# EAGLE schematic 26-de-8x (EAGLE 6.6.0)

## Sheet 1 of 4
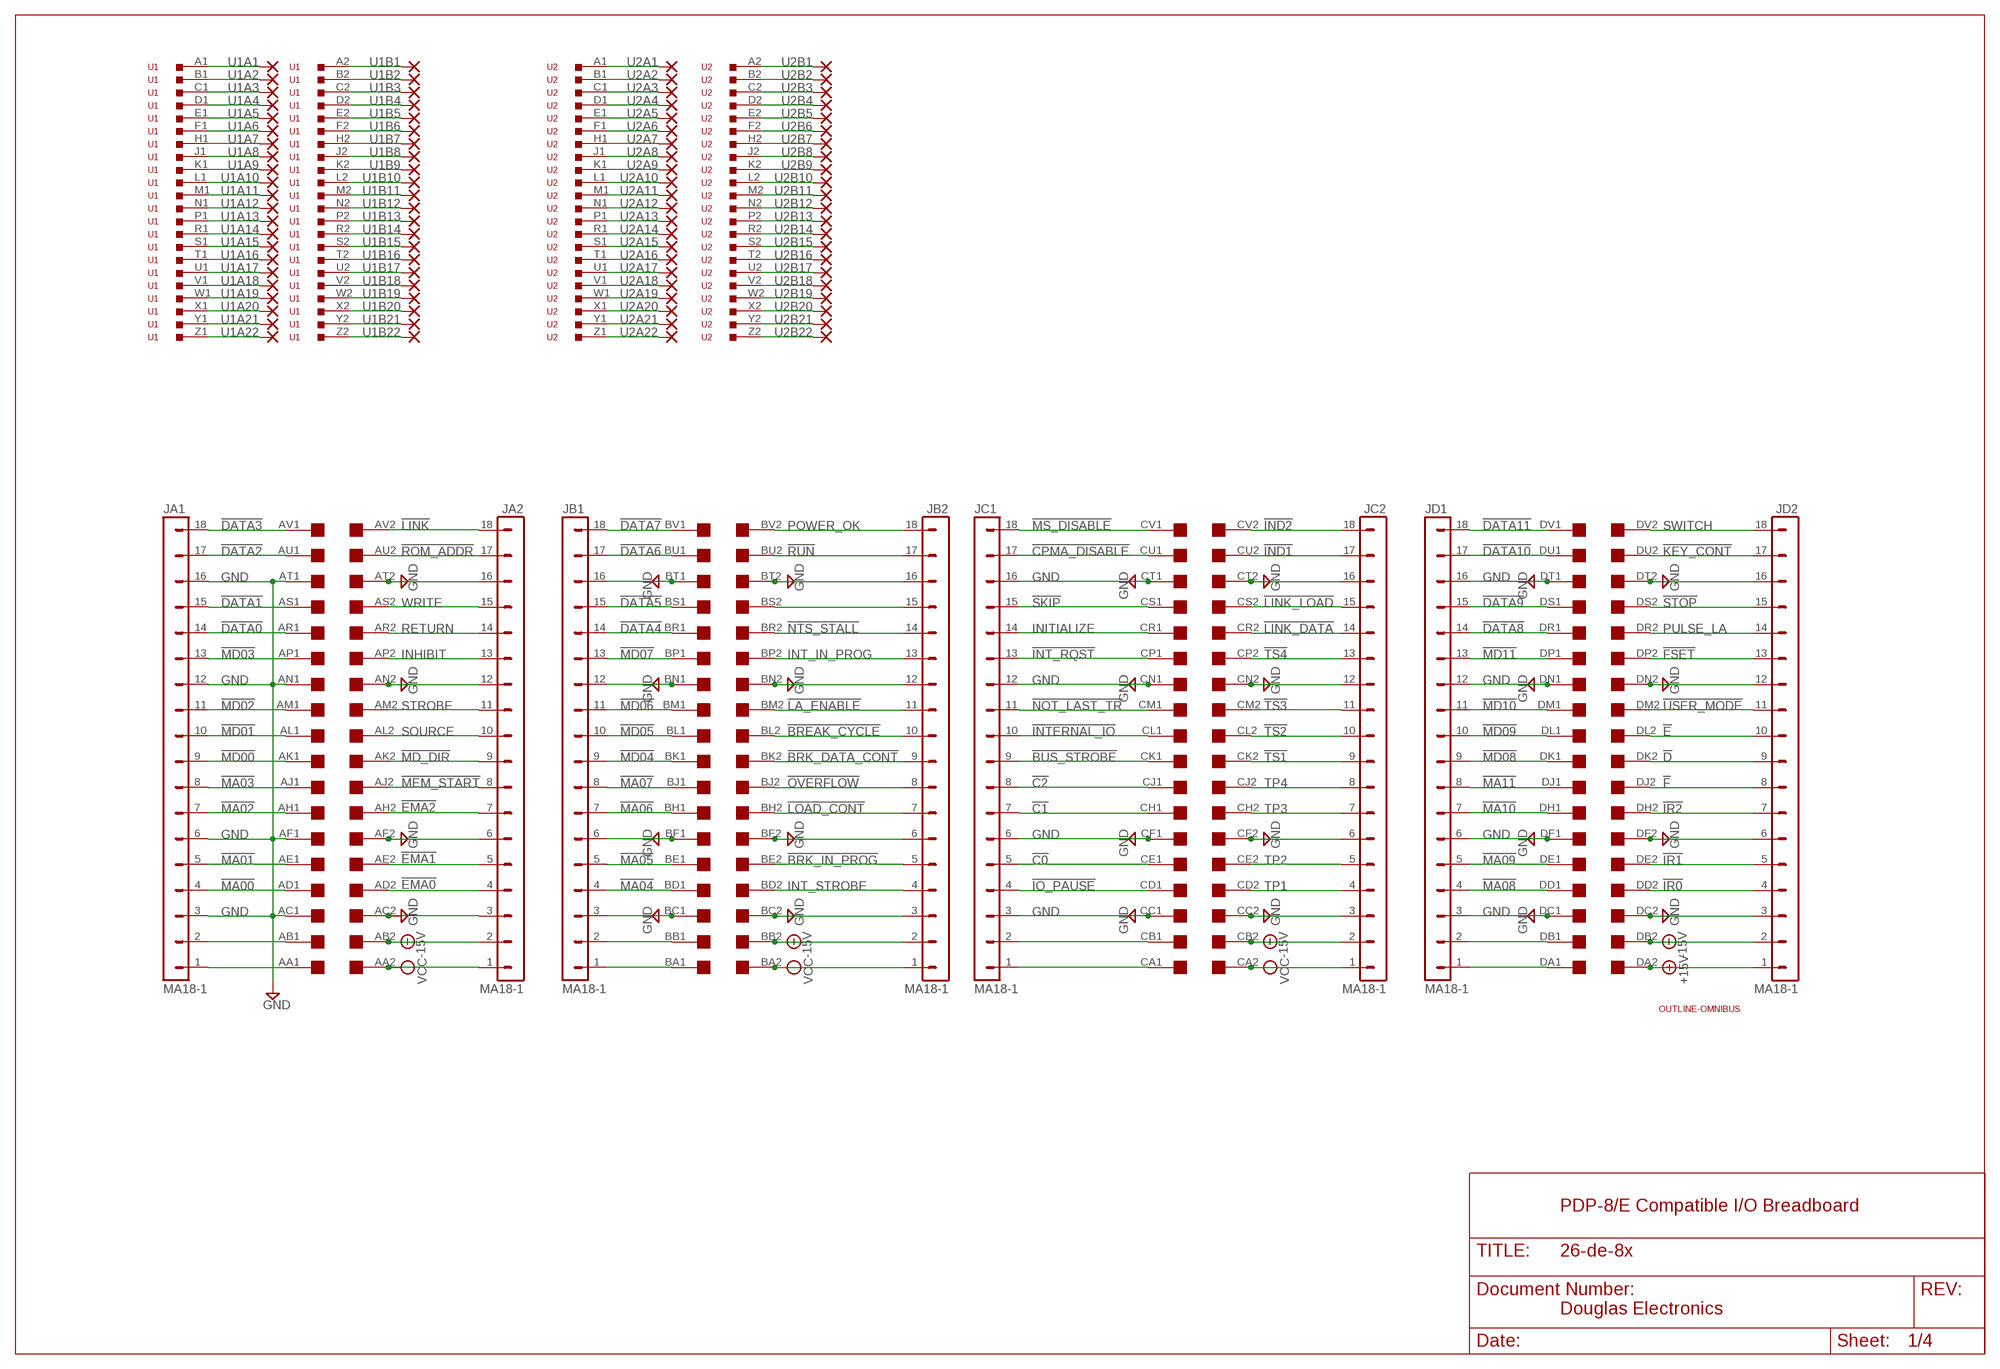
[diagram p0: schematic, sheet 1]

### Parts
JA1  MA18-1  [MA18-1]
JA2  MA18-1  [MA18-1]
JB1  MA18-1  [MA18-1]
JB2  MA18-1  [MA18-1]
JC1  MA18-1  [MA18-1]
JC2  MA18-1  [MA18-1]
JD1  MA18-1  [MA18-1]
JD2  MA18-1  [MA18-1]
U1  133-022-03  [133-022-03]
U1A1  1,6/0,8  [1,6/0,8]
U1A2  1,6/0,8  [1,6/0,8]
U1A3  1,6/0,8  [1,6/0,8]
U1A4  1,6/0,8  [1,6/0,8]
U1A5  1,6/0,8  [1,6/0,8]
U1A6  1,6/0,8  [1,6/0,8]
U1A7  1,6/0,8  [1,6/0,8]
U1A8  1,6/0,8  [1,6/0,8]
U1A9  1,6/0,8  [1,6/0,8]
U1A10  1,6/0,8  [1,6/0,8]
U1A11  1,6/0,8  [1,6/0,8]
U1A12  1,6/0,8  [1,6/0,8]
U1A13  1,6/0,8  [1,6/0,8]
U1A14  1,6/0,8  [1,6/0,8]
U1A15  1,6/0,8  [1,6/0,8]
U1A16  1,6/0,8  [1,6/0,8]
U1A17  1,6/0,8  [1,6/0,8]
U1A18  1,6/0,8  [1,6/0,8]
U1A19  1,6/0,8  [1,6/0,8]
U1A20  1,6/0,8  [1,6/0,8]
U1A21  1,6/0,8  [1,6/0,8]
U1A22  1,6/0,8  [1,6/0,8]
U1B1  1,6/0,8  [1,6/0,8]
U1B2  1,6/0,8  [1,6/0,8]
U1B3  1,6/0,8  [1,6/0,8]
U1B4  1,6/0,8  [1,6/0,8]
U1B5  1,6/0,8  [1,6/0,8]
U1B6  1,6/0,8  [1,6/0,8]
U1B7  1,6/0,8  [1,6/0,8]
U1B8  1,6/0,8  [1,6/0,8]
U1B9  1,6/0,8  [1,6/0,8]
U1B10  1,6/0,8  [1,6/0,8]
U1B11  1,6/0,8  [1,6/0,8]
U1B12  1,6/0,8  [1,6/0,8]
U1B13  1,6/0,8  [1,6/0,8]
U1B14  1,6/0,8  [1,6/0,8]
U1B15  1,6/0,8  [1,6/0,8]
U1B16  1,6/0,8  [1,6/0,8]
U1B17  1,6/0,8  [1,6/0,8]
U1B18  1,6/0,8  [1,6/0,8]
U1B19  1,6/0,8  [1,6/0,8]
U1B20  1,6/0,8  [1,6/0,8]
U1B21  1,6/0,8  [1,6/0,8]
U1B22  1,6/0,8  [1,6/0,8]
U2  133-022-03  [133-022-03]
U2A1  1,6/0,8  [1,6/0,8]
U2A2  1,6/0,8  [1,6/0,8]
U2A3  1,6/0,8  [1,6/0,8]
U2A4  1,6/0,8  [1,6/0,8]
U2A5  1,6/0,8  [1,6/0,8]
U2A6  1,6/0,8  [1,6/0,8]
U2A7  1,6/0,8  [1,6/0,8]
U2A8  1,6/0,8  [1,6/0,8]
U2A9  1,6/0,8  [1,6/0,8]
U2A10  1,6/0,8  [1,6/0,8]
U2A11  1,6/0,8  [1,6/0,8]
U2A12  1,6/0,8  [1,6/0,8]
U2A13  1,6/0,8  [1,6/0,8]
U2A14  1,6/0,8  [1,6/0,8]
U2A15  1,6/0,8  [1,6/0,8]
U2A16  1,6/0,8  [1,6/0,8]
U2A17  1,6/0,8  [1,6/0,8]
U2A18  1,6/0,8  [1,6/0,8]
U2A19  1,6/0,8  [1,6/0,8]
U2A20  1,6/0,8  [1,6/0,8]
U2A21  1,6/0,8  [1,6/0,8]
U2A22  1,6/0,8  [1,6/0,8]
U2B1  1,6/0,8  [1,6/0,8]
U2B2  1,6/0,8  [1,6/0,8]
U2B3  1,6/0,8  [1,6/0,8]
U2B4  1,6/0,8  [1,6/0,8]
U2B5  1,6/0,8  [1,6/0,8]
U2B6  1,6/0,8  [1,6/0,8]
U2B7  1,6/0,8  [1,6/0,8]
U2B8  1,6/0,8  [1,6/0,8]
U2B9  1,6/0,8  [1,6/0,8]
U2B10  1,6/0,8  [1,6/0,8]
U2B11  1,6/0,8  [1,6/0,8]
U2B12  1,6/0,8  [1,6/0,8]
U2B13  1,6/0,8  [1,6/0,8]
U2B14  1,6/0,8  [1,6/0,8]
U2B15  1,6/0,8  [1,6/0,8]
U2B16  1,6/0,8  [1,6/0,8]
U2B17  1,6/0,8  [1,6/0,8]
U2B18  1,6/0,8  [1,6/0,8]
U2B19  1,6/0,8  [1,6/0,8]
U2B20  1,6/0,8  [1,6/0,8]
U2B21  1,6/0,8  [1,6/0,8]
U2B22  1,6/0,8  [1,6/0,8]
U$1  OUTLINE-OMNIBUS  [OMNIBUS]
U$2  QUAD  [EDGE-CON8]

### Nets
!BREAK_CYCLE: JB2.10 U$2.BL2
!BRK_DATA_CONT: JB2.9 U$2.BK2
!BRK_IN_PROG: JB2.5 U$2.BE2
!BUS_STROBE: JC1.9 U$2.CK1
!C0: JC1.5 U$2.CE1 ; also sheet 2
!C1: JC1.7 U$2.CH1 ; also sheet 2
!C2: JC1.8 U$2.CJ1
!CPMA_DISABLE: JC1.17 U$2.CU1
!D: JD2.9 U$2.DK2
!DATA0: JA1.14 U$2.AR1 ; also sheet 2
!DATA1: JA1.15 U$2.AS1 ; also sheet 2
!DATA2: JA1.17 U$2.AU1 ; also sheet 2
!DATA3: JA1.18 U$2.AV1 ; also sheet 2
!DATA4: JB1.14 U$2.BR1 ; also sheet 2
!DATA5: JB1.15 U$2.BS1 ; also sheet 2
!DATA6: JB1.17 U$2.BU1 ; also sheet 2
!DATA7: JB1.18 U$2.BV1 ; also sheet 2
!DATA8: JD1.14 U$2.DR1 ; also sheet 2
!DATA9: JD1.15 U$2.DS1 ; also sheet 2
!DATA10: JD1.17 U$2.DU1 ; also sheet 2
!DATA11: JD1.18 U$2.DV1 ; also sheet 2
!E: JD2.10 U$2.DL2
!EMA0: JA2.4 U$2.AD2
!EMA1: JA2.5 U$2.AE2
!EMA2: JA2.7 U$2.AH2
!F: JD2.8 U$2.DJ2
!FSET: JD2.13 U$2.DP2
!IND1: JC2.17 U$2.CU2
!IND2: JC2.18 U$2.CV2
!INT_RQST: JC1.13 U$2.CP1 ; also sheet 2
!INTERNAL_IO: JC1.10 U$2.CL1 ; also sheet 2
!IO_PAUSE: JC1.4 U$2.CD1 ; also sheet 2
!IR0: JD2.4 U$2.DD2
!IR1: JD2.5 U$2.DE2
!IR2: JD2.7 U$2.DH2
!KEY_CONT: JD2.17 U$2.DU2
!LA_ENABLE: JB2.11 U$2.BM2
!LINK: JA2.18 U$2.AV2
!LINK_DATA: JC2.14 U$2.CR2
!LINK_LOAD: JC2.15 U$2.CS2
!LOAD_CONT: JB2.7 U$2.BH2
!MA00: JA1.4 U$2.AD1
!MA01: JA1.5 U$2.AE1
!MA02: JA1.7 U$2.AH1
!MA03: JA1.8 U$2.AJ1
!MA04: JB1.4 U$2.BD1
!MA05: JB1.5 U$2.BE1
!MA06: JB1.7 U$2.BH1
!MA07: JB1.8 U$2.BJ1
!MA08: JD1.4 U$2.DD1
!MA09: JD1.5 U$2.DE1
!MA10: JD1.7 U$2.DH1
!MA11: JD1.8 U$2.DJ1
!MD00: JA1.9 U$2.AK1
!MD01: JA1.10 U$2.AL1
!MD02: JA1.11 U$2.AM1
!MD03: JA1.13 U$2.AP1 ; also sheet 2
!MD04: JB1.9 U$2.BK1 ; also sheet 2
!MD05: JB1.10 U$2.BL1 ; also sheet 2
!MD06: JB1.11 U$2.BM1 ; also sheet 2
!MD07: JB1.13 U$2.BP1 ; also sheet 2
!MD08: JD1.9 U$2.DK1 ; also sheet 2
!MD09: JD1.10 U$2.DL1 ; also sheet 2
!MD10: JD1.11 U$2.DM1 ; also sheet 2
!MD11: JD1.13 U$2.DP1 ; also sheet 2
!MD_DIR: JA2.9 U$2.AK2
!MEM_START: JA2.8 U$2.AJ2
!MS_DISABLE: JC1.18 U$2.CV1
!NOT_LAST_TR: JC1.11 U$2.CM1
!NTS_STALL: JB2.14 U$2.BR2
!OVERFLOW: JB2.8 U$2.BJ2
!ROM_ADDR: JA2.17 U$2.AU2
!RUN: JB2.17 U$2.BU2
!SKIP: JC1.15 U$2.CS1 ; also sheet 2
!STOP: JD2.15 U$2.DS2
!TS1: JC2.9 U$2.CK2
!TS2: JC2.10 U$2.CL2
!TS3: JC2.11 U$2.CM2
!TS4: JC2.13 U$2.CP2
!USER_MODE: JD2.11 U$2.DM2
+15V: JD2.1 U$2.DA2
-15V [supply]: JA2.2 JB2.2 JC2.2 JD2.2 U$2.AB2 U$2.BB2 U$2.CB2 U$2.DB2
GND [supply]: JA1.3 JA1.6 JA1.12 JA1.16 JA2.3 JA2.6 JA2.12 JA2.16 JB1.3 JB1.6 JB1.12 JB1.16 JB2.3 JB2.6 JB2.12 JB2.16 JC1.3 JC1.6 JC1.12 JC1.16 JC2.3 JC2.6 JC2.12 JC2.16 JD1.3 JD1.6 JD1.12 JD1.16 JD2.3 JD2.6 JD2.12 JD2.16 U$2.AC1 U$2.AC2 U$2.AF1 U$2.AF2 U$2.AN1 U$2.AN2 U$2.AT1 U$2.AT2 U$2.BC1 U$2.BC2 U$2.BF1 U$2.BF2 U$2.BN1 U$2.BN2 U$2.BT1 U$2.BT2 U$2.CC1 U$2.CC2 U$2.CF1 U$2.CF2 U$2.CN1 U$2.CN2 U$2.CT1 U$2.CT2 U$2.DC1 U$2.DC2 U$2.DF1 U$2.DF2 U$2.DN1 U$2.DN2 U$2.DT1 U$2.DT2 ; also sheet 2,3,4
INHIBIT: JA2.13 U$2.AP2
INITIALIZE: JC1.14 U$2.CR1
INT_IN_PROG: JB2.13 U$2.BP2
INT_STROBE: JB2.4 U$2.BD2
N$46: JA1.2 U$2.AB1
N$47: JA1.1 U$2.AA1
N$48: JB1.2 U$2.BB1
N$49: JB1.1 U$2.BA1
N$50: JC1.1 U$2.CA1
N$51: JB2.15 U$2.BS2
N$52: JC1.2 U$2.CB1
N$53: JD1.1 U$2.DA1
N$54: JD1.2 U$2.DB1
N$243: U1.A2 U1B1.1(P)
N$244: U1.B1 U1A2.1(P)
N$245: U1.C1 U1A3.1(P)
N$246: U1.D1 U1A4.1(P)
N$479: U1.E1 U1A5.1(P)
N$480: U1.F1 U1A6.1(P)
N$481: U1.H1 U1A7.1(P)
N$482: U1.J1 U1A8.1(P)
N$483: U1.K1 U1A9.1(P)
N$484: U1.L1 U1A10.1(P)
N$485: U1.M1 U1A11.1(P)
N$486: U1.N1 U1A12.1(P)
N$487: U1.P1 U1A13.1(P)
N$488: U1.R1 U1A14.1(P)
N$489: U1.S1 U1A15.1(P)
N$490: U1.T1 U1A16.1(P)
N$491: U1.U1 U1A17.1(P)
N$492: U1.V1 U1A18.1(P)
N$493: U1.W1 U1A19.1(P)
N$494: U1.X1 U1A20.1(P)
N$495: U1.Y1 U1A21.1(P)
N$496: U1.Z1 U1A22.1(P)
N$497: U1.A1 U1A1.1(P)
N$498: U1.B2 U1B2.1(P)
N$499: U1.C2 U1B3.1(P)
N$500: U1.D2 U1B4.1(P)
N$501: U1.E2 U1B5.1(P)
N$502: U1.F2 U1B6.1(P)
N$503: U1.H2 U1B7.1(P)
N$504: U1.J2 U1B8.1(P)
N$505: U1.K2 U1B9.1(P)
N$506: U1.L2 U1B10.1(P)
N$507: U1.M2 U1B11.1(P)
N$508: U1.N2 U1B12.1(P)
N$509: U1.P2 U1B13.1(P)
N$510: U1.R2 U1B14.1(P)
N$511: U1.S2 U1B15.1(P)
N$512: U1.T2 U1B16.1(P)
N$513: U1.U2 U1B17.1(P)
N$514: U1.V2 U1B18.1(P)
N$515: U1.W2 U1B19.1(P)
N$516: U1.X2 U1B20.1(P)
N$517: U1.Y2 U1B21.1(P)
N$518: U1.Z2 U1B22.1(P)
N$519: U2.A1 U2A1.1(P)
N$520: U2.A2 U2B1.1(P)
N$521: U2.B1 U2A2.1(P)
N$522: U2.C1 U2A3.1(P)
N$523: U2.D1 U2A4.1(P)
N$524: U2.E1 U2A5.1(P)
N$525: U2.F1 U2A6.1(P)
N$526: U2.H1 U2A7.1(P)
N$527: U2.J1 U2A8.1(P)
N$528: U2.K1 U2A9.1(P)
N$529: U2.L1 U2A10.1(P)
N$530: U2.M1 U2A11.1(P)
N$531: U2.N1 U2A12.1(P)
N$532: U2.P1 U2A13.1(P)
N$533: U2.R1 U2A14.1(P)
N$534: U2.S1 U2A15.1(P)
N$535: U2.T1 U2A16.1(P)
N$536: U2.U1 U2A17.1(P)
N$537: U2.V1 U2A18.1(P)
N$538: U2.W1 U2A19.1(P)
N$539: U2.X1 U2A20.1(P)
N$540: U2.Y1 U2A21.1(P)
N$541: U2.Z1 U2A22.1(P)
N$542: U2.B2 U2B2.1(P)
N$543: U2.C2 U2B3.1(P)
N$544: U2.D2 U2B4.1(P)
N$545: U2.E2 U2B5.1(P)
N$546: U2.F2 U2B6.1(P)
N$547: U2.H2 U2B7.1(P)
N$548: U2.J2 U2B8.1(P)
N$549: U2.K2 U2B9.1(P)
N$550: U2.L2 U2B10.1(P)
N$551: U2.M2 U2B11.1(P)
N$552: U2.N2 U2B12.1(P)
N$553: U2.P2 U2B13.1(P)
N$554: U2.R2 U2B14.1(P)
N$555: U2.S2 U2B15.1(P)
N$556: U2.T2 U2B16.1(P)
N$557: U2.U2 U2B17.1(P)
N$558: U2.V2 U2B18.1(P)
N$559: U2.W2 U2B19.1(P)
N$560: U2.X2 U2B20.1(P)
N$561: U2.Y2 U2B21.1(P)
N$562: U2.Z2 U2B22.1(P)
POWER_OK: JB2.18 U$2.BV2
PULSE_LA: JD2.14 U$2.DR2
RETURN: JA2.14 U$2.AR2
SOURCE: JA2.10 U$2.AL2
STROBE: JA2.11 U$2.AM2
SWITCH: JD2.18 U$2.DV2
TP1: JC2.4 U$2.CD2
TP2: JC2.5 U$2.CE2
TP3: JC2.7 U$2.CH2 ; also sheet 2
TP4: JC2.8 U$2.CJ2
VCC [supply]: JA2.1 JB2.1 JC2.1 U$2.AA2 U$2.BA2 U$2.CA2 ; also sheet 2,3,4
WRITE: JA2.15 U$2.AS2

### Notes on the sheet
- PDP-8/E Compatible I/O Breadboard
- Douglas Electronics

## Sheet 2 of 4
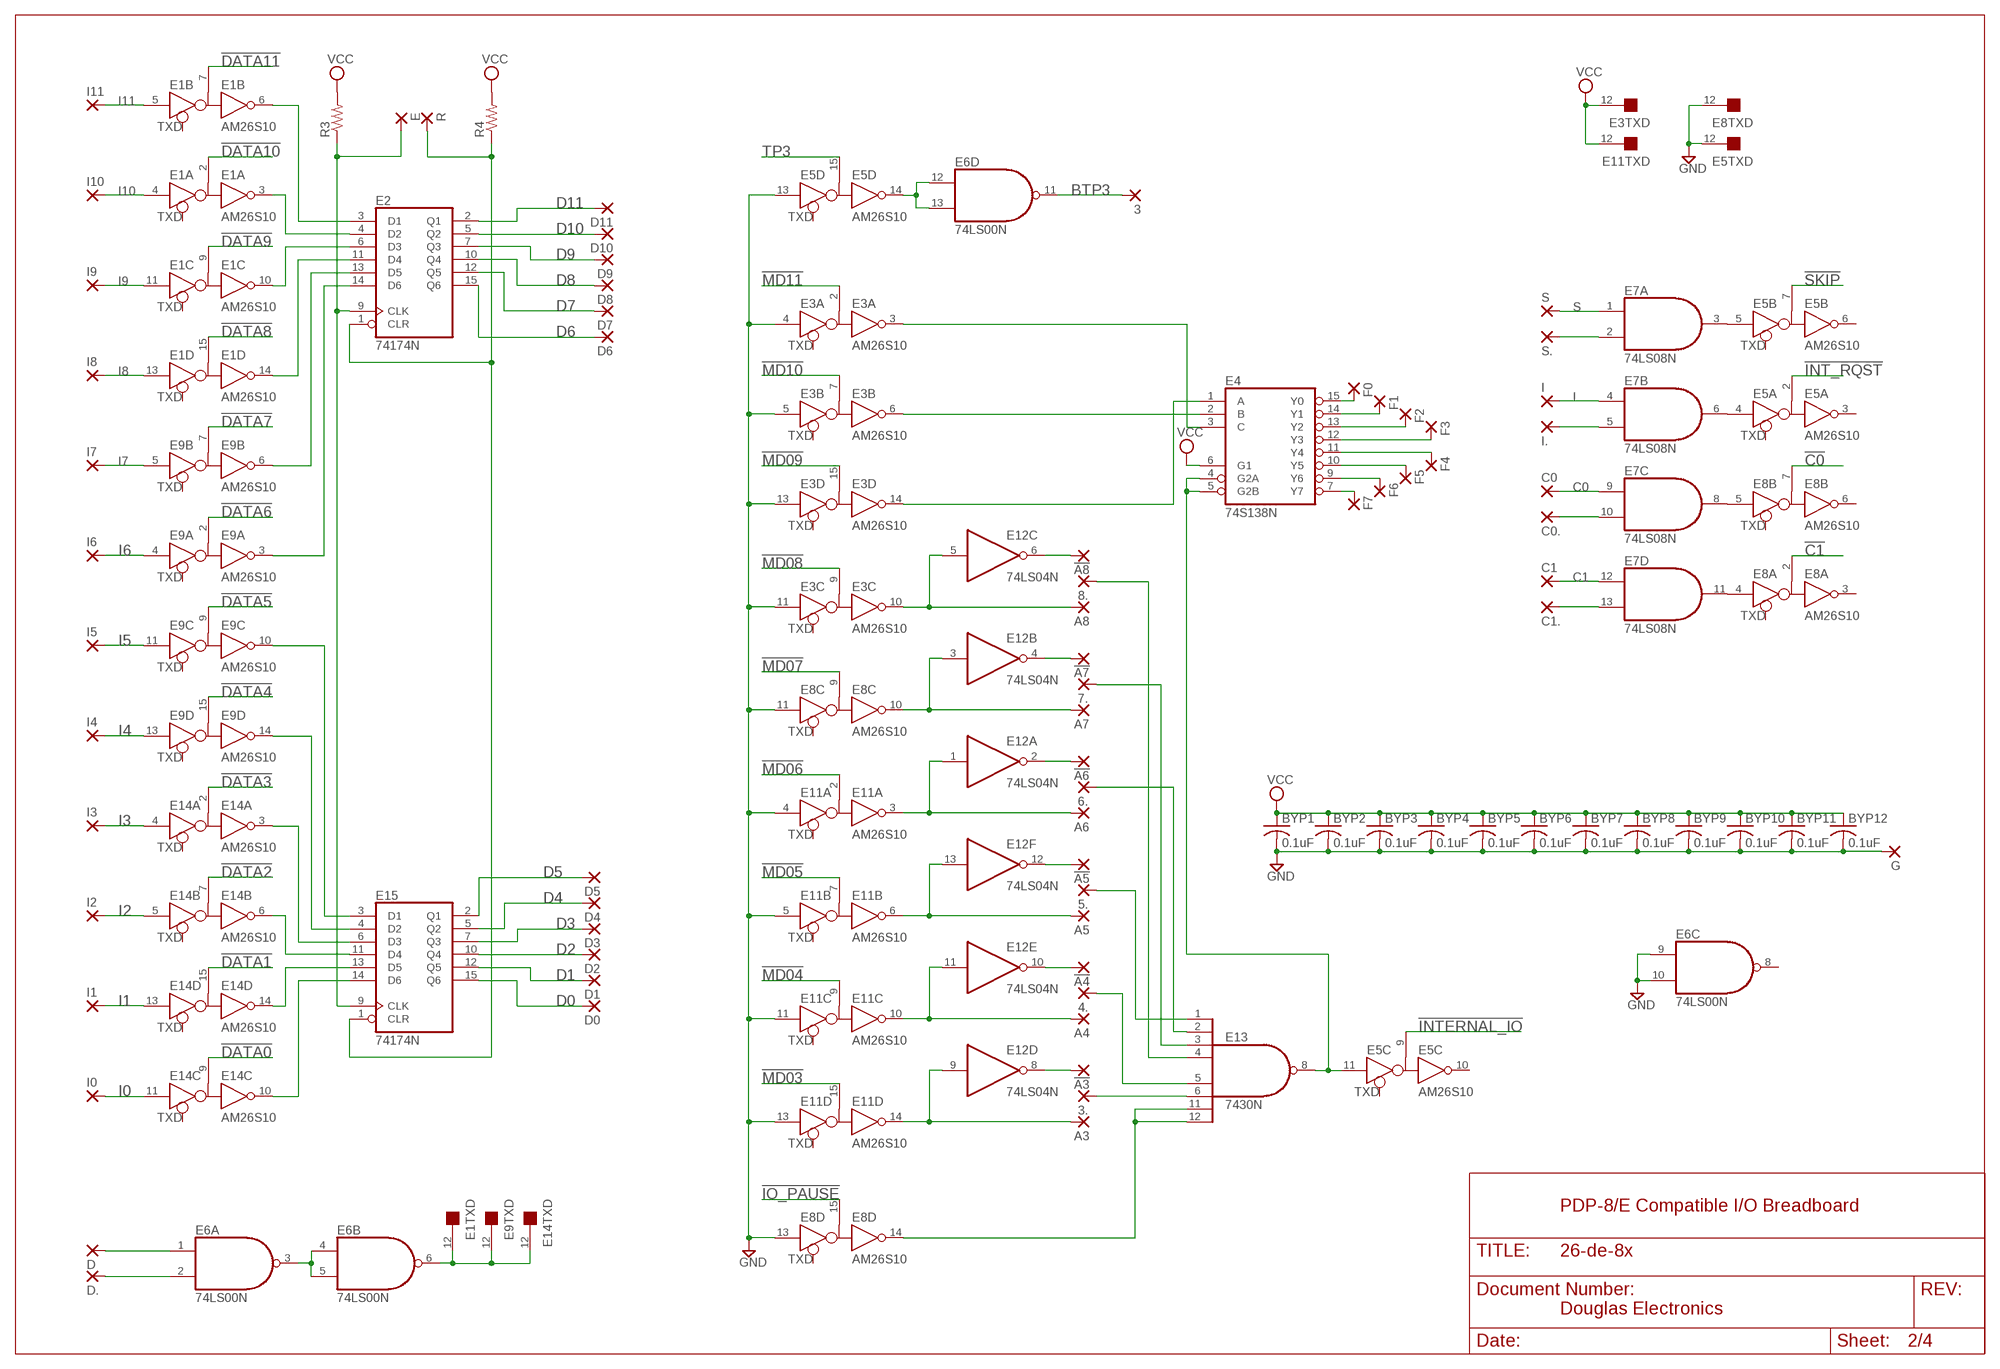
[diagram p1: schematic, sheet 2]

### Parts
3  1,6/0,8  [1,6/0,8]
3.  1,6/0,8  [1,6/0,8]
4.  1,6/0,8  [1,6/0,8]
5.  1,6/0,8  [1,6/0,8]
6.  1,6/0,8  [1,6/0,8]
7.  1,6/0,8  [1,6/0,8]
8.  1,6/0,8  [1,6/0,8]
!A3  1,6/0,8  [1,6/0,8]
!A4  1,6/0,8  [1,6/0,8]
!A5  1,6/0,8  [1,6/0,8]
!A6  1,6/0,8  [1,6/0,8]
!A7  1,6/0,8  [1,6/0,8]
!A8  1,6/0,8  [1,6/0,8]
A3  1,6/0,8  [1,6/0,8]
A4  1,6/0,8  [1,6/0,8]
A5  1,6/0,8  [1,6/0,8]
A6  1,6/0,8  [1,6/0,8]
A7  1,6/0,8  [1,6/0,8]
A8  1,6/0,8  [1,6/0,8]
BYP1  0.1uF  C-US050-025X075  [C050-025X075]
BYP2  0.1uF  C-US050-025X075  [C050-025X075]
BYP3  0.1uF  C-US050-025X075  [C050-025X075]
BYP4  0.1uF  C-US050-025X075  [C050-025X075]
BYP5  0.1uF  C-US050-025X075  [C050-025X075]
BYP6  0.1uF  C-US050-025X075  [C050-025X075]
BYP7  0.1uF  C-US050-025X075  [C050-025X075]
BYP8  0.1uF  C-US050-025X075  [C050-025X075]
BYP9  0.1uF  C-US050-025X075  [C050-025X075]
BYP10  0.1uF  C-US050-025X075  [C050-025X075]
BYP11  0.1uF  C-US050-025X075  [C050-025X075]
BYP12  0.1uF  C-US050-025X075  [C050-025X075]
C0  1,6/0,8  [1,6/0,8]
C0.  1,6/0,8  [1,6/0,8]
C1  1,6/0,8  [1,6/0,8]
C1.  1,6/0,8  [1,6/0,8]
D  1,6/0,8  [1,6/0,8]
D0  1,6/0,8  [1,6/0,8]
D1  1,6/0,8  [1,6/0,8]
D2  1,6/0,8  [1,6/0,8]
D3  1,6/0,8  [1,6/0,8]
D4  1,6/0,8  [1,6/0,8]
D5  1,6/0,8  [1,6/0,8]
D6  1,6/0,8  [1,6/0,8]
D7  1,6/0,8  [1,6/0,8]
D8  1,6/0,8  [1,6/0,8]
D9  1,6/0,8  [1,6/0,8]
D10  1,6/0,8  [1,6/0,8]
D11  1,6/0,8  [1,6/0,8]
D.  1,6/0,8  [1,6/0,8]
E  1,6/0,8  [1,6/0,8]
E1  AM26S10  [DIL16]
E2  74174N  [DIL16]
E3  AM26S10  [DIL16]
E4  74S138N  [DIL16]
E5  AM26S10  [DIL16]
E6  74LS00N  [DIL14]
E7  74LS08N  [DIL14]
E8  AM26S10  [DIL16]
E9  AM26S10  [DIL16]
E11  AM26S10  [DIL16]
E12  74LS04N  [DIL14]
E13  7430N  [DIL14]
E14  AM26S10  [DIL16]
E15  74174N  [DIL16]
F0  1,6/0,8  [1,6/0,8]
F1  1,6/0,8  [1,6/0,8]
F2  1,6/0,8  [1,6/0,8]
F3  1,6/0,8  [1,6/0,8]
F4  1,6/0,8  [1,6/0,8]
F5  1,6/0,8  [1,6/0,8]
F6  1,6/0,8  [1,6/0,8]
F7  1,6/0,8  [1,6/0,8]
G  1,6/0,8  [1,6/0,8]
I  1,6/0,8  [1,6/0,8]
I0  1,6/0,8  [1,6/0,8]
I1  1,6/0,8  [1,6/0,8]
I2  1,6/0,8  [1,6/0,8]
I3  1,6/0,8  [1,6/0,8]
I4  1,6/0,8  [1,6/0,8]
I5  1,6/0,8  [1,6/0,8]
I6  1,6/0,8  [1,6/0,8]
I7  1,6/0,8  [1,6/0,8]
I8  1,6/0,8  [1,6/0,8]
I9  1,6/0,8  [1,6/0,8]
I10  1,6/0,8  [1,6/0,8]
I11  1,6/0,8  [1,6/0,8]
I.  1,6/0,8  [1,6/0,8]
R  1,6/0,8  [1,6/0,8]
R3  R-US_0207/10  [0207/10]
R4  R-US_0207/10  [0207/10]
S  1,6/0,8  [1,6/0,8]
S.  1,6/0,8  [1,6/0,8]

### Nets
!C0: E8.7(B:B) ; also sheet 1
!C1: E8.2(A:B) ; also sheet 1
!DATA0: E14.9(C:B) ; also sheet 1
!DATA1: E14.15(D:B) ; also sheet 1
!DATA2: E14.7(B:B) ; also sheet 1
!DATA3: E14.2(A:B) ; also sheet 1
!DATA4: E9.15(D:B) ; also sheet 1
!DATA5: E9.9(C:B) ; also sheet 1
!DATA6: E9.2(A:B) ; also sheet 1
!DATA7: E9.7(B:B) ; also sheet 1
!DATA8: E1.15(D:B) ; also sheet 1
!DATA9: E1.9(C:B) ; also sheet 1
!DATA10: E1.2(A:B) ; also sheet 1
!DATA11: E1.7(B:B) ; also sheet 1
!INT_RQST: E5.2(A:B) ; also sheet 1
!INTERNAL_IO: E5.9(C:B) ; also sheet 1
!IO_PAUSE: E8.15(D:B) ; also sheet 1
!MD03: E11.15(D:B) ; also sheet 1
!MD04: E11.9(C:B) ; also sheet 1
!MD05: E11.7(B:B) ; also sheet 1
!MD06: E11.2(A:B) ; also sheet 1
!MD07: E8.9(C:B) ; also sheet 1
!MD08: E3.9(C:B) ; also sheet 1
!MD09: E3.15(D:B) ; also sheet 1
!MD10: E3.7(B:B) ; also sheet 1
!MD11: E3.2(A:B) ; also sheet 1
!SKIP: E5.7(B:B) ; also sheet 1
BTP3: 3.1(P) E6.11(D:O)
C0: C0.1(P) E7.9(C:I0)
C1: C1.1(P) E7.12(D:I0)
D0: D0.1(P) E15.15(Q6)
D1: D1.1(P) E15.12(Q5)
D2: D2.1(P) E15.10(Q4)
D3: D3.1(P) E15.7(Q3)
D4: D4.1(P) E15.5(Q2)
D5: D5.1(P) E15.2(Q1)
D6: D6.1(P) E2.15(Q6)
D7: D7.1(P) E2.12(Q5)
D8: D8.1(P) E2.10(Q4)
D9: D9.1(P) E2.7(Q3)
D10: D10.1(P) E2.5(Q2)
D11: D11.1(P) E2.2(Q1)
GND [supply]: BYP1.2 BYP2.2 BYP3.2 BYP4.2 BYP5.2 BYP6.2 BYP7.2 BYP8.2 BYP9.2 BYP10.2 BYP11.2 BYP12.2 E3.4(A:D) E3.5(B:D) E3.11(C:D) E3.13(D:D) E5.12(TXD:TXD) E5.13(D:D) E6.9(C:I0) E6.10(C:I1) E8.11(C:D) E8.12(TXD:TXD) E8.13(D:D) E11.4(A:D) E11.5(B:D) E11.11(C:D) E11.13(D:D) G.1(P) ; also sheet 1,3,4
I: E7.4(B:I0) I.1(P)
I0: E14.11(C:D) I0.1(P)
I1: E14.13(D:D) I1.1(P)
I2: E14.5(B:D) I2.1(P)
I3: E14.4(A:D) I3.1(P)
I4: E9.13(D:D) I4.1(P)
I5: E9.11(C:D) I5.1(P)
I6: E9.4(A:D) I6.1(P)
I7: E9.5(B:D) I7.1(P)
I8: E1.13(D:D) I8.1(P)
I9: E1.11(C:D) I9.1(P)
I10: E1.4(A:D) I10.1(P)
I11: E1.5(B:D) I11.1(P)
N$1: E1.12(TXD:TXD) E6.6(B:O) E9.12(TXD:TXD) E14.12(TXD:TXD)
N$18: E4.15(Y0) F0.1(P)
N$19: E4.14(Y1) F1.1(P)
N$20: E4.13(Y2) F2.1(P)
N$21: E4.12(Y3) F3.1(P)
N$22: E4.11(Y4) F4.1(P)
N$23: E4.10(Y5) F5.1(P)
N$24: E4.9(Y6) F6.1(P)
N$25: E4.7(Y7) F7.1(P)
N$42: E4.4(G2A) E4.5(G2B) E5.11(C:D) E13.8(O)
N$43: E14.10(C:R) E15.14(D6)
N$44: E14.3(A:R) E15.6(D3)
N$45: E9.10(C:R) E15.3(D1)
N$563: A8.1(P) E3.10(C:R) E12.5(C:I)
N$564: A7.1(P) E8.10(C:R) E12.3(B:I)
N$565: A6.1(P) E11.3(A:R) E12.1(A:I)
N$566: A5.1(P) E11.6(B:R) E12.13(F:I)
N$567: A3.1(P) E11.14(D:R) E12.9(D:I)
N$568: A4.1(P) E11.10(C:R) E12.11(E:I)
N$569: E5.5(B:D) E7.3(A:O)
N$570: E5.4(A:D) E7.6(B:O)
N$571: E7.8(C:O) E8.5(B:D)
N$572: E7.11(D:O) E8.4(A:D)
N$573: !A3.1(P) E12.8(D:O)
N$574: !A4.1(P) E12.10(E:O)
N$575: !A5.1(P) E12.12(F:O)
N$576: !A6.1(P) E12.2(A:O)
N$577: !A7.1(P) E12.4(B:O)
N$578: !A8.1(P) E12.6(C:O)
N$579: E6.3(A:O) E6.4(B:I0) E6.5(B:I1)
N$827: E9.14(D:R) E15.4(D2)
N$828: E14.14(D:R) E15.13(D5)
N$829: E2.14(D6) E9.3(A:R)
N$830: E14.6(B:R) E15.11(D4)
N$831: E2.13(D5) E9.6(B:R)
N$832: E1.6(B:R) E2.3(D1)
N$833: E1.3(A:R) E2.4(D2)
N$834: E1.10(C:R) E2.6(D3)
N$835: E1.14(D:R) E2.11(D4)
N$836: E2.9(CLK) E15.9(CLK) E.1(P) R3.1
N$837: E2.1(CLR) E15.1(CLR) R4.1 R.1(P)
N$850: E8.14(D:R) E13.11(I6) E13.12(I7)
N$851: E3.3(A:R) E4.3(C)
N$858: E3.6(B:R) E4.2(B)
N$859: 3..1(P) E13.6(I5)
N$860: 4..1(P) E13.5(I4)
N$862: 5..1(P) E13.1(I0)
N$863: E3.14(D:R) E4.1(A)
N$864: E5.14(D:R) E6.12(D:I0) E6.13(D:I1)
N$866: D..1(P) E6.2(A:I1)
N$867: D.1(P) E6.1(A:I0)
N$869: 8..1(P) E13.4(I3)
N$870: 7..1(P) E13.3(I2)
N$871: 6..1(P) E13.2(I1)
N$878: E7.2(A:I1) S..1(P)
N$880: E7.5(B:I1) I..1(P)
N$882: C0..1(P) E7.10(C:I1)
N$883: C1..1(P) E7.13(D:I1)
S: E7.1(A:I0) S.1(P)
TP3: E5.15(D:B) ; also sheet 1
VCC [supply]: BYP1.1 BYP2.1 BYP3.1 BYP4.1 BYP5.1 BYP6.1 BYP7.1 BYP8.1 BYP9.1 BYP10.1 BYP11.1 BYP12.1 E3.12(TXD:TXD) E4.6(G1) E11.12(TXD:TXD) R3.2 R4.2 ; also sheet 1,3,4
Unconnected: E5.3(A:R) E5.6(B:R) E5.10(C:R) E6.8(C:O) E8.3(A:R) E8.6(B:R)

### Notes on the sheet
- PDP-8/E Compatible I/O Breadboard
- Douglas Electronics

## Sheet 3 of 4
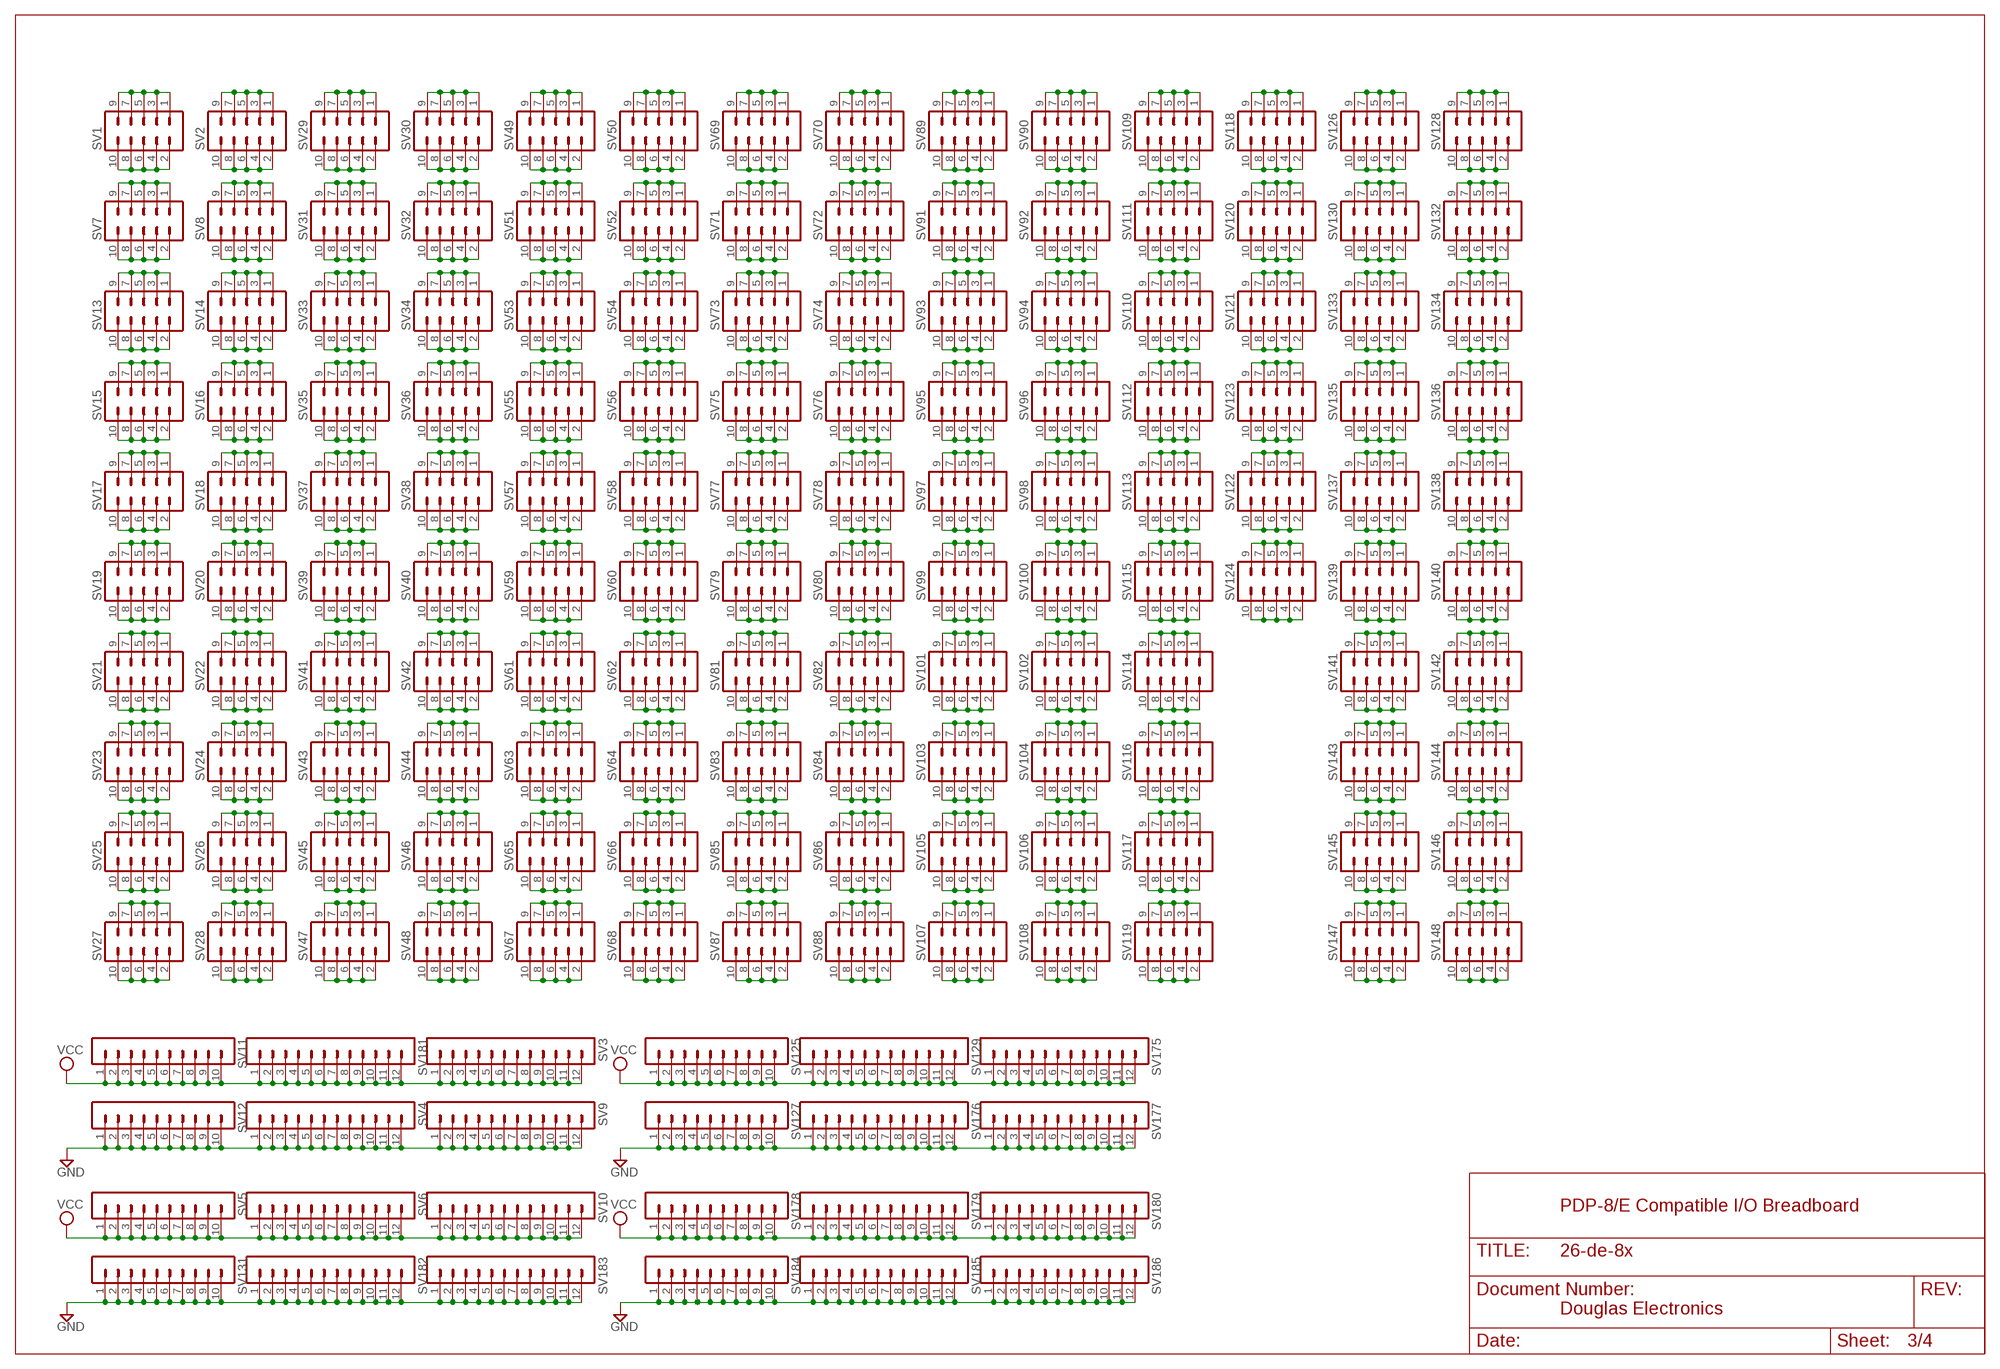
[diagram p2: schematic, sheet 3]

### Parts
SV1  MA05-2  [MA05-2]
SV2  MA05-2  [MA05-2]
SV3  MA12-1  [MA12-1]
SV4  MA12-1  [MA12-1]
SV5  MA10-1  [MA10-1]
SV6  MA12-1  [MA12-1]
SV7  MA05-2  [MA05-2]
SV8  MA05-2  [MA05-2]
SV9  MA12-1  [MA12-1]
SV10  MA12-1  [MA12-1]
SV11  MA10-1  [MA10-1]
SV12  MA10-1  [MA10-1]
SV13  MA05-2  [MA05-2]
SV14  MA05-2  [MA05-2]
SV15  MA05-2  [MA05-2]
SV16  MA05-2  [MA05-2]
SV17  MA05-2  [MA05-2]
SV18  MA05-2  [MA05-2]
SV19  MA05-2  [MA05-2]
SV20  MA05-2  [MA05-2]
SV21  MA05-2  [MA05-2]
SV22  MA05-2  [MA05-2]
SV23  MA05-2  [MA05-2]
SV24  MA05-2  [MA05-2]
SV25  MA05-2  [MA05-2]
SV26  MA05-2  [MA05-2]
SV27  MA05-2  [MA05-2]
SV28  MA05-2  [MA05-2]
SV29  MA05-2  [MA05-2]
SV30  MA05-2  [MA05-2]
SV31  MA05-2  [MA05-2]
SV32  MA05-2  [MA05-2]
SV33  MA05-2  [MA05-2]
SV34  MA05-2  [MA05-2]
SV35  MA05-2  [MA05-2]
SV36  MA05-2  [MA05-2]
SV37  MA05-2  [MA05-2]
SV38  MA05-2  [MA05-2]
SV39  MA05-2  [MA05-2]
SV40  MA05-2  [MA05-2]
SV41  MA05-2  [MA05-2]
SV42  MA05-2  [MA05-2]
SV43  MA05-2  [MA05-2]
SV44  MA05-2  [MA05-2]
SV45  MA05-2  [MA05-2]
SV46  MA05-2  [MA05-2]
SV47  MA05-2  [MA05-2]
SV48  MA05-2  [MA05-2]
SV49  MA05-2  [MA05-2]
SV50  MA05-2  [MA05-2]
SV51  MA05-2  [MA05-2]
SV52  MA05-2  [MA05-2]
SV53  MA05-2  [MA05-2]
SV54  MA05-2  [MA05-2]
SV55  MA05-2  [MA05-2]
SV56  MA05-2  [MA05-2]
SV57  MA05-2  [MA05-2]
SV58  MA05-2  [MA05-2]
SV59  MA05-2  [MA05-2]
SV60  MA05-2  [MA05-2]
SV61  MA05-2  [MA05-2]
SV62  MA05-2  [MA05-2]
SV63  MA05-2  [MA05-2]
SV64  MA05-2  [MA05-2]
SV65  MA05-2  [MA05-2]
SV66  MA05-2  [MA05-2]
SV67  MA05-2  [MA05-2]
SV68  MA05-2  [MA05-2]
SV69  MA05-2  [MA05-2]
SV70  MA05-2  [MA05-2]
SV71  MA05-2  [MA05-2]
SV72  MA05-2  [MA05-2]
SV73  MA05-2  [MA05-2]
SV74  MA05-2  [MA05-2]
SV75  MA05-2  [MA05-2]
SV76  MA05-2  [MA05-2]
SV77  MA05-2  [MA05-2]
SV78  MA05-2  [MA05-2]
SV79  MA05-2  [MA05-2]
SV80  MA05-2  [MA05-2]
SV81  MA05-2  [MA05-2]
SV82  MA05-2  [MA05-2]
SV83  MA05-2  [MA05-2]
SV84  MA05-2  [MA05-2]
SV85  MA05-2  [MA05-2]
SV86  MA05-2  [MA05-2]
SV87  MA05-2  [MA05-2]
SV88  MA05-2  [MA05-2]
SV89  MA05-2  [MA05-2]
SV90  MA05-2  [MA05-2]
SV91  MA05-2  [MA05-2]
SV92  MA05-2  [MA05-2]
SV93  MA05-2  [MA05-2]
SV94  MA05-2  [MA05-2]
SV95  MA05-2  [MA05-2]
SV96  MA05-2  [MA05-2]
SV97  MA05-2  [MA05-2]
SV98  MA05-2  [MA05-2]
SV99  MA05-2  [MA05-2]
SV100  MA05-2  [MA05-2]
SV101  MA05-2  [MA05-2]
SV102  MA05-2  [MA05-2]
SV103  MA05-2  [MA05-2]
SV104  MA05-2  [MA05-2]
SV105  MA05-2  [MA05-2]
SV106  MA05-2  [MA05-2]
SV107  MA05-2  [MA05-2]
SV108  MA05-2  [MA05-2]
SV109  MA05-2  [MA05-2]
SV110  MA05-2  [MA05-2]
SV111  MA05-2  [MA05-2]
SV112  MA05-2  [MA05-2]
SV113  MA05-2  [MA05-2]
SV114  MA05-2  [MA05-2]
SV115  MA05-2  [MA05-2]
SV116  MA05-2  [MA05-2]
SV117  MA05-2  [MA05-2]
SV118  MA05-2  [MA05-2]
SV119  MA05-2  [MA05-2]
SV120  MA05-2  [MA05-2]
SV121  MA05-2  [MA05-2]
SV122  MA05-2  [MA05-2]
SV123  MA05-2  [MA05-2]
SV124  MA05-2  [MA05-2]
SV125  MA10-1  [MA10-1]
SV126  MA05-2  [MA05-2]
SV127  MA10-1  [MA10-1]
SV128  MA05-2  [MA05-2]
SV129  MA12-1  [MA12-1]
SV130  MA05-2  [MA05-2]
SV131  MA10-1  [MA10-1]
SV132  MA05-2  [MA05-2]
SV133  MA05-2  [MA05-2]
SV134  MA05-2  [MA05-2]
SV135  MA05-2  [MA05-2]
SV136  MA05-2  [MA05-2]
SV137  MA05-2  [MA05-2]
SV138  MA05-2  [MA05-2]
SV139  MA05-2  [MA05-2]
SV140  MA05-2  [MA05-2]
SV141  MA05-2  [MA05-2]
SV142  MA05-2  [MA05-2]
SV143  MA05-2  [MA05-2]
SV144  MA05-2  [MA05-2]
SV145  MA05-2  [MA05-2]
SV146  MA05-2  [MA05-2]
SV147  MA05-2  [MA05-2]
SV148  MA05-2  [MA05-2]
SV175  MA12-1  [MA12-1]
SV176  MA12-1  [MA12-1]
SV177  MA12-1  [MA12-1]
SV178  MA10-1  [MA10-1]
SV179  MA12-1  [MA12-1]
SV180  MA12-1  [MA12-1]
SV181  MA12-1  [MA12-1]
SV182  MA12-1  [MA12-1]
SV183  MA12-1  [MA12-1]
SV184  MA10-1  [MA10-1]
SV185  MA12-1  [MA12-1]
SV186  MA12-1  [MA12-1]

### Nets
GND [supply]: SV4.1 SV4.2 SV4.3 SV4.4 SV4.5 SV4.6 SV4.7 SV4.8 SV4.9 SV4.10 SV4.11 SV4.12 SV9.1 SV9.2 SV9.3 SV9.4 SV9.5 SV9.6 SV9.7 SV9.8 SV9.9 SV9.10 SV9.11 SV9.12 SV12.1 SV12.2 SV12.3 SV12.4 SV12.5 SV12.6 SV12.7 SV12.8 SV12.9 SV12.10 SV127.1 SV127.2 SV127.3 SV127.4 SV127.5 SV127.6 SV127.7 SV127.8 SV127.9 SV127.10 SV131.1 SV131.2 SV131.3 SV131.4 SV131.5 SV131.6 SV131.7 SV131.8 SV131.9 SV131.10 SV176.1 SV176.2 SV176.3 SV176.4 SV176.5 SV176.6 SV176.7 SV176.8 SV176.9 SV176.10 SV176.11 SV176.12 SV177.1 SV177.2 SV177.3 SV177.4 SV177.5 SV177.6 SV177.7 SV177.8 SV177.9 SV177.10 SV177.11 SV177.12 SV182.1 SV182.2 SV182.3 SV182.4 SV182.5 SV182.6 SV182.7 SV182.8 SV182.9 SV182.10 SV182.11 SV182.12 SV183.1 SV183.2 SV183.3 SV183.4 SV183.5 SV183.6 SV183.7 SV183.8 SV183.9 SV183.10 SV183.11 SV183.12 SV184.1 SV184.2 SV184.3 SV184.4 SV184.5 SV184.6 SV184.7 SV184.8 SV184.9 SV184.10 SV185.1 SV185.2 SV185.3 SV185.4 SV185.5 SV185.6 SV185.7 SV185.8 SV185.9 SV185.10 SV185.11 SV185.12 SV186.1 SV186.2 SV186.3 SV186.4 SV186.5 SV186.6 SV186.7 SV186.8 SV186.9 SV186.10 SV186.11 SV186.12 ; also sheet 1,2,4
N$247: SV1.1 SV1.3 SV1.5 SV1.7 SV1.9
N$248: SV1.2 SV1.4 SV1.6 SV1.8 SV1.10
N$249: SV7.1 SV7.3 SV7.5 SV7.7 SV7.9
N$250: SV2.1 SV2.3 SV2.5 SV2.7 SV2.9
N$251: SV2.2 SV2.4 SV2.6 SV2.8 SV2.10
N$252: SV7.2 SV7.4 SV7.6 SV7.8 SV7.10
N$253: SV8.1 SV8.3 SV8.5 SV8.7 SV8.9
N$254: SV8.2 SV8.4 SV8.6 SV8.8 SV8.10
N$255: SV13.1 SV13.3 SV13.5 SV13.7 SV13.9
N$256: SV13.2 SV13.4 SV13.6 SV13.8 SV13.10
N$257: SV14.1 SV14.3 SV14.5 SV14.7 SV14.9
N$258: SV14.2 SV14.4 SV14.6 SV14.8 SV14.10
N$259: SV15.1 SV15.3 SV15.5 SV15.7 SV15.9
N$260: SV15.2 SV15.4 SV15.6 SV15.8 SV15.10
N$261: SV16.1 SV16.3 SV16.5 SV16.7 SV16.9
N$262: SV16.2 SV16.4 SV16.6 SV16.8 SV16.10
N$263: SV17.1 SV17.3 SV17.5 SV17.7 SV17.9
N$264: SV17.2 SV17.4 SV17.6 SV17.8 SV17.10
N$265: SV18.1 SV18.3 SV18.5 SV18.7 SV18.9
N$266: SV18.2 SV18.4 SV18.6 SV18.8 SV18.10
N$267: SV19.1 SV19.3 SV19.5 SV19.7 SV19.9
N$268: SV19.2 SV19.4 SV19.6 SV19.8 SV19.10
N$269: SV20.1 SV20.3 SV20.5 SV20.7 SV20.9
N$270: SV20.2 SV20.4 SV20.6 SV20.8 SV20.10
N$271: SV21.1 SV21.3 SV21.5 SV21.7 SV21.9
N$272: SV21.2 SV21.4 SV21.6 SV21.8 SV21.10
N$273: SV22.1 SV22.3 SV22.5 SV22.7 SV22.9
N$274: SV22.2 SV22.4 SV22.6 SV22.8 SV22.10
N$275: SV23.1 SV23.3 SV23.5 SV23.7 SV23.9
N$276: SV23.2 SV23.4 SV23.6 SV23.8 SV23.10
N$277: SV24.1 SV24.3 SV24.5 SV24.7 SV24.9
N$278: SV24.2 SV24.4 SV24.6 SV24.8 SV24.10
N$279: SV25.1 SV25.3 SV25.5 SV25.7 SV25.9
N$280: SV25.2 SV25.4 SV25.6 SV25.8 SV25.10
N$281: SV26.1 SV26.3 SV26.5 SV26.7 SV26.9
N$282: SV26.2 SV26.4 SV26.6 SV26.8 SV26.10
N$283: SV27.1 SV27.3 SV27.5 SV27.7 SV27.9
N$284: SV27.2 SV27.4 SV27.6 SV27.8 SV27.10
N$285: SV28.1 SV28.3 SV28.5 SV28.7 SV28.9
N$286: SV28.2 SV28.4 SV28.6 SV28.8 SV28.10
N$287: SV29.1 SV29.3 SV29.5 SV29.7 SV29.9
N$288: SV29.2 SV29.4 SV29.6 SV29.8 SV29.10
N$289: SV30.1 SV30.3 SV30.5 SV30.7 SV30.9
N$290: SV30.2 SV30.4 SV30.6 SV30.8 SV30.10
N$291: SV31.1 SV31.3 SV31.5 SV31.7 SV31.9
N$292: SV31.2 SV31.4 SV31.6 SV31.8 SV31.10
N$293: SV32.1 SV32.3 SV32.5 SV32.7 SV32.9
N$294: SV32.2 SV32.4 SV32.6 SV32.8 SV32.10
N$295: SV33.1 SV33.3 SV33.5 SV33.7 SV33.9
N$296: SV33.2 SV33.4 SV33.6 SV33.8 SV33.10
N$297: SV34.1 SV34.3 SV34.5 SV34.7 SV34.9
N$298: SV34.2 SV34.4 SV34.6 SV34.8 SV34.10
N$299: SV35.1 SV35.3 SV35.5 SV35.7 SV35.9
N$300: SV35.2 SV35.4 SV35.6 SV35.8 SV35.10
N$301: SV36.1 SV36.3 SV36.5 SV36.7 SV36.9
N$302: SV36.2 SV36.4 SV36.6 SV36.8 SV36.10
N$303: SV37.1 SV37.3 SV37.5 SV37.7 SV37.9
N$304: SV37.2 SV37.4 SV37.6 SV37.8 SV37.10
N$305: SV38.1 SV38.3 SV38.5 SV38.7 SV38.9
N$306: SV38.2 SV38.4 SV38.6 SV38.8 SV38.10
N$307: SV39.1 SV39.3 SV39.5 SV39.7 SV39.9
N$308: SV39.2 SV39.4 SV39.6 SV39.8 SV39.10
N$309: SV40.1 SV40.3 SV40.5 SV40.7 SV40.9
N$310: SV40.2 SV40.4 SV40.6 SV40.8 SV40.10
N$311: SV41.1 SV41.3 SV41.5 SV41.7 SV41.9
N$312: SV41.2 SV41.4 SV41.6 SV41.8 SV41.10
N$313: SV42.1 SV42.3 SV42.5 SV42.7 SV42.9
N$314: SV42.2 SV42.4 SV42.6 SV42.8 SV42.10
N$315: SV43.1 SV43.3 SV43.5 SV43.7 SV43.9
N$316: SV43.2 SV43.4 SV43.6 SV43.8 SV43.10
N$317: SV44.1 SV44.3 SV44.5 SV44.7 SV44.9
N$318: SV44.2 SV44.4 SV44.6 SV44.8 SV44.10
N$319: SV45.1 SV45.3 SV45.5 SV45.7 SV45.9
N$320: SV45.2 SV45.4 SV45.6 SV45.8 SV45.10
N$321: SV46.1 SV46.3 SV46.5 SV46.7 SV46.9
N$322: SV46.2 SV46.4 SV46.6 SV46.8 SV46.10
N$323: SV47.1 SV47.3 SV47.5 SV47.7 SV47.9
N$324: SV47.2 SV47.4 SV47.6 SV47.8 SV47.10
N$325: SV48.1 SV48.3 SV48.5 SV48.7 SV48.9
N$326: SV48.2 SV48.4 SV48.6 SV48.8 SV48.10
N$327: SV49.1 SV49.3 SV49.5 SV49.7 SV49.9
N$328: SV49.2 SV49.4 SV49.6 SV49.8 SV49.10
N$329: SV50.1 SV50.3 SV50.5 SV50.7 SV50.9
N$330: SV50.2 SV50.4 SV50.6 SV50.8 SV50.10
N$331: SV51.1 SV51.3 SV51.5 SV51.7 SV51.9
N$332: SV51.2 SV51.4 SV51.6 SV51.8 SV51.10
N$333: SV52.1 SV52.3 SV52.5 SV52.7 SV52.9
N$334: SV52.2 SV52.4 SV52.6 SV52.8 SV52.10
N$335: SV53.1 SV53.3 SV53.5 SV53.7 SV53.9
N$336: SV53.2 SV53.4 SV53.6 SV53.8 SV53.10
N$337: SV54.1 SV54.3 SV54.5 SV54.7 SV54.9
N$338: SV54.2 SV54.4 SV54.6 SV54.8 SV54.10
N$339: SV55.1 SV55.3 SV55.5 SV55.7 SV55.9
N$340: SV55.2 SV55.4 SV55.6 SV55.8 SV55.10
N$341: SV56.1 SV56.3 SV56.5 SV56.7 SV56.9
N$342: SV56.2 SV56.4 SV56.6 SV56.8 SV56.10
N$343: SV57.1 SV57.3 SV57.5 SV57.7 SV57.9
N$344: SV57.2 SV57.4 SV57.6 SV57.8 SV57.10
N$345: SV58.1 SV58.3 SV58.5 SV58.7 SV58.9
N$346: SV58.2 SV58.4 SV58.6 SV58.8 SV58.10
N$347: SV59.1 SV59.3 SV59.5 SV59.7 SV59.9
N$348: SV59.2 SV59.4 SV59.6 SV59.8 SV59.10
N$349: SV60.1 SV60.3 SV60.5 SV60.7 SV60.9
N$350: SV60.2 SV60.4 SV60.6 SV60.8 SV60.10
N$351: SV61.1 SV61.3 SV61.5 SV61.7 SV61.9
N$352: SV61.2 SV61.4 SV61.6 SV61.8 SV61.10
N$353: SV62.1 SV62.3 SV62.5 SV62.7 SV62.9
N$354: SV62.2 SV62.4 SV62.6 SV62.8 SV62.10
N$355: SV63.1 SV63.3 SV63.5 SV63.7 SV63.9
N$356: SV63.2 SV63.4 SV63.6 SV63.8 SV63.10
N$357: SV64.1 SV64.3 SV64.5 SV64.7 SV64.9
N$358: SV64.2 SV64.4 SV64.6 SV64.8 SV64.10
N$359: SV65.1 SV65.3 SV65.5 SV65.7 SV65.9
N$360: SV65.2 SV65.4 SV65.6 SV65.8 SV65.10
N$361: SV66.1 SV66.3 SV66.5 SV66.7 SV66.9
N$362: SV66.2 SV66.4 SV66.6 SV66.8 SV66.10
N$363: SV67.1 SV67.3 SV67.5 SV67.7 SV67.9
N$364: SV67.2 SV67.4 SV67.6 SV67.8 SV67.10
N$365: SV68.1 SV68.3 SV68.5 SV68.7 SV68.9
N$366: SV68.2 SV68.4 SV68.6 SV68.8 SV68.10
N$367: SV69.1 SV69.3 SV69.5 SV69.7 SV69.9
N$368: SV69.2 SV69.4 SV69.6 SV69.8 SV69.10
N$369: SV70.1 SV70.3 SV70.5 SV70.7 SV70.9
N$370: SV70.2 SV70.4 SV70.6 SV70.8 SV70.10
N$371: SV71.1 SV71.3 SV71.5 SV71.7 SV71.9
N$372: SV71.2 SV71.4 SV71.6 SV71.8 SV71.10
N$373: SV72.1 SV72.3 SV72.5 SV72.7 SV72.9
N$374: SV72.2 SV72.4 SV72.6 SV72.8 SV72.10
N$375: SV73.1 SV73.3 SV73.5 SV73.7 SV73.9
N$376: SV73.2 SV73.4 SV73.6 SV73.8 SV73.10
N$377: SV74.1 SV74.3 SV74.5 SV74.7 SV74.9
N$378: SV74.2 SV74.4 SV74.6 SV74.8 SV74.10
N$379: SV75.1 SV75.3 SV75.5 SV75.7 SV75.9
N$380: SV75.2 SV75.4 SV75.6 SV75.8 SV75.10
N$381: SV76.1 SV76.3 SV76.5 SV76.7 SV76.9
N$382: SV76.2 SV76.4 SV76.6 SV76.8 SV76.10
N$383: SV77.1 SV77.3 SV77.5 SV77.7 SV77.9
N$384: SV77.2 SV77.4 SV77.6 SV77.8 SV77.10
N$385: SV78.1 SV78.3 SV78.5 SV78.7 SV78.9
N$386: SV78.2 SV78.4 SV78.6 SV78.8 SV78.10
N$387: SV79.1 SV79.3 SV79.5 SV79.7 SV79.9
N$388: SV79.2 SV79.4 SV79.6 SV79.8 SV79.10
N$389: SV80.1 SV80.3 SV80.5 SV80.7 SV80.9
N$390: SV80.2 SV80.4 SV80.6 SV80.8 SV80.10
N$391: SV81.1 SV81.3 SV81.5 SV81.7 SV81.9
N$392: SV81.2 SV81.4 SV81.6 SV81.8 SV81.10
N$393: SV82.1 SV82.3 SV82.5 SV82.7 SV82.9
N$394: SV82.2 SV82.4 SV82.6 SV82.8 SV82.10
N$395: SV83.1 SV83.3 SV83.5 SV83.7 SV83.9
N$396: SV83.2 SV83.4 SV83.6 SV83.8 SV83.10
N$397: SV84.1 SV84.3 SV84.5 SV84.7 SV84.9
N$398: SV84.2 SV84.4 SV84.6 SV84.8 SV84.10
N$399: SV85.1 SV85.3 SV85.5 SV85.7 SV85.9
N$400: SV85.2 SV85.4 SV85.6 SV85.8 SV85.10
N$401: SV86.1 SV86.3 SV86.5 SV86.7 SV86.9
N$402: SV86.2 SV86.4 SV86.6 SV86.8 SV86.10
N$403: SV87.1 SV87.3 SV87.5 SV87.7 SV87.9
N$404: SV87.2 SV87.4 SV87.6 SV87.8 SV87.10
N$405: SV88.1 SV88.3 SV88.5 SV88.7 SV88.9
N$406: SV88.2 SV88.4 SV88.6 SV88.8 SV88.10
N$407: SV89.1 SV89.3 SV89.5 SV89.7 SV89.9
N$408: SV89.2 SV89.4 SV89.6 SV89.8 SV89.10
N$409: SV90.1 SV90.3 SV90.5 SV90.7 SV90.9
N$410: SV90.2 SV90.4 SV90.6 SV90.8 SV90.10
N$411: SV91.1 SV91.3 SV91.5 SV91.7 SV91.9
N$412: SV91.2 SV91.4 SV91.6 SV91.8 SV91.10
N$413: SV92.1 SV92.3 SV92.5 SV92.7 SV92.9
N$414: SV92.2 SV92.4 SV92.6 SV92.8 SV92.10
N$415: SV93.1 SV93.3 SV93.5 SV93.7 SV93.9
N$416: SV93.2 SV93.4 SV93.6 SV93.8 SV93.10
N$417: SV94.1 SV94.3 SV94.5 SV94.7 SV94.9
N$418: SV94.2 SV94.4 SV94.6 SV94.8 SV94.10
N$419: SV95.1 SV95.3 SV95.5 SV95.7 SV95.9
N$420: SV95.2 SV95.4 SV95.6 SV95.8 SV95.10
N$421: SV96.1 SV96.3 SV96.5 SV96.7 SV96.9
N$422: SV96.2 SV96.4 SV96.6 SV96.8 SV96.10
N$423: SV97.1 SV97.3 SV97.5 SV97.7 SV97.9
N$424: SV97.2 SV97.4 SV97.6 SV97.8 SV97.10
N$425: SV98.1 SV98.3 SV98.5 SV98.7 SV98.9
N$426: SV98.2 SV98.4 SV98.6 SV98.8 SV98.10
N$427: SV99.1 SV99.3 SV99.5 SV99.7 SV99.9
N$428: SV99.2 SV99.4 SV99.6 SV99.8 SV99.10
N$429: SV100.1 SV100.3 SV100.5 SV100.7 SV100.9
N$430: SV100.2 SV100.4 SV100.6 SV100.8 SV100.10
N$431: SV101.1 SV101.3 SV101.5 SV101.7 SV101.9
N$432: SV101.2 SV101.4 SV101.6 SV101.8 SV101.10
N$433: SV102.1 SV102.3 SV102.5 SV102.7 SV102.9
N$434: SV102.2 SV102.4 SV102.6 SV102.8 SV102.10
N$435: SV103.1 SV103.3 SV103.5 SV103.7 SV103.9
N$436: SV103.2 SV103.4 SV103.6 SV103.8 SV103.10
N$437: SV104.1 SV104.3 SV104.5 SV104.7 SV104.9
N$438: SV104.2 SV104.4 SV104.6 SV104.8 SV104.10
N$439: SV105.1 SV105.3 SV105.5 SV105.7 SV105.9
N$440: SV105.2 SV105.4 SV105.6 SV105.8 SV105.10
N$441: SV106.1 SV106.3 SV106.5 SV106.7 SV106.9
N$442: SV106.2 SV106.4 SV106.6 SV106.8 SV106.10
N$443: SV107.1 SV107.3 SV107.5 SV107.7 SV107.9
N$444: SV107.2 SV107.4 SV107.6 SV107.8 SV107.10
N$445: SV108.1 SV108.3 SV108.5 SV108.7 SV108.9
N$446: SV108.2 SV108.4 SV108.6 SV108.8 SV108.10
N$447: SV109.1 SV109.3 SV109.5 SV109.7 SV109.9
N$448: SV109.2 SV109.4 SV109.6 SV109.8 SV109.10
N$449: SV110.1 SV110.3 SV110.5 SV110.7 SV110.9
N$450: SV110.2 SV110.4 SV110.6 SV110.8 SV110.10
N$451: SV111.1 SV111.3 SV111.5 SV111.7 SV111.9
N$452: SV111.2 SV111.4 SV111.6 SV111.8 SV111.10
N$453: SV112.1 SV112.3 SV112.5 SV112.7 SV112.9
N$454: SV112.2 SV112.4 SV112.6 SV112.8 SV112.10
N$455: SV113.1 SV113.3 SV113.5 SV113.7 SV113.9
N$456: SV113.2 SV113.4 SV113.6 SV113.8 SV113.10
N$457: SV114.1 SV114.3 SV114.5 SV114.7 SV114.9
N$458: SV114.2 SV114.4 SV114.6 SV114.8 SV114.10
N$459: SV115.1 SV115.3 SV115.5 SV115.7 SV115.9
N$460: SV115.2 SV115.4 SV115.6 SV115.8 SV115.10
N$461: SV116.1 SV116.3 SV116.5 SV116.7 SV116.9
N$462: SV116.2 SV116.4 SV116.6 SV116.8 SV116.10
N$463: SV117.1 SV117.3 SV117.5 SV117.7 SV117.9
N$464: SV117.2 SV117.4 SV117.6 SV117.8 SV117.10
N$465: SV118.1 SV118.3 SV118.5 SV118.7 SV118.9
N$466: SV118.2 SV118.4 SV118.6 SV118.8 SV118.10
N$467: SV119.1 SV119.3 SV119.5 SV119.7 SV119.9
N$468: SV119.2 SV119.4 SV119.6 SV119.8 SV119.10
N$469: SV120.1 SV120.3 SV120.5 SV120.7 SV120.9
N$470: SV120.2 SV120.4 SV120.6 SV120.8 SV120.10
N$471: SV121.1 SV121.3 SV121.5 SV121.7 SV121.9
N$472: SV121.2 SV121.4 SV121.6 SV121.8 SV121.10
N$473: SV122.1 SV122.3 SV122.5 SV122.7 SV122.9
N$474: SV122.2 SV122.4 SV122.6 SV122.8 SV122.10
N$475: SV123.1 SV123.3 SV123.5 SV123.7 SV123.9
N$476: SV123.2 SV123.4 SV123.6 SV123.8 SV123.10
N$477: SV124.1 SV124.3 SV124.5 SV124.7 SV124.9
N$478: SV124.2 SV124.4 SV124.6 SV124.8 SV124.10
N$655: SV126.1 SV126.3 SV126.5 SV126.7 SV126.9
N$656: SV126.2 SV126.4 SV126.6 SV126.8 SV126.10
N$657: SV128.1 SV128.3 SV128.5 SV128.7 SV128.9
N$658: SV128.2 SV128.4 SV128.6 SV128.8 SV128.10
N$659: SV130.1 SV130.3 SV130.5 SV130.7 SV130.9
N$660: SV130.2 SV130.4 SV130.6 SV130.8 SV130.10
N$661: SV132.1 SV132.3 SV132.5 SV132.7 SV132.9
N$662: SV132.2 SV132.4 SV132.6 SV132.8 SV132.10
N$663: SV133.1 SV133.3 SV133.5 SV133.7 SV133.9
N$664: SV133.2 SV133.4 SV133.6 SV133.8 SV133.10
N$665: SV134.1 SV134.3 SV134.5 SV134.7 SV134.9
N$666: SV134.2 SV134.4 SV134.6 SV134.8 SV134.10
N$667: SV135.1 SV135.3 SV135.5 SV135.7 SV135.9
N$668: SV135.2 SV135.4 SV135.6 SV135.8 SV135.10
N$669: SV136.1 SV136.3 SV136.5 SV136.7 SV136.9
N$670: SV136.2 SV136.4 SV136.6 SV136.8 SV136.10
N$671: SV137.1 SV137.3 SV137.5 SV137.7 SV137.9
N$672: SV137.2 SV137.4 SV137.6 SV137.8 SV137.10
N$673: SV138.1 SV138.3 SV138.5 SV138.7 SV138.9
N$674: SV138.2 SV138.4 SV138.6 SV138.8 SV138.10
N$675: SV139.1 SV139.3 SV139.5 SV139.7 SV139.9
N$676: SV139.2 SV139.4 SV139.6 SV139.8 SV139.10
N$677: SV140.1 SV140.3 SV140.5 SV140.7 SV140.9
N$678: SV140.2 SV140.4 SV140.6 SV140.8 SV140.10
N$679: SV141.1 SV141.3 SV141.5 SV141.7 SV141.9
N$680: SV141.2 SV141.4 SV141.6 SV141.8 SV141.10
N$681: SV142.1 SV142.3 SV142.5 SV142.7 SV142.9
N$682: SV142.2 SV142.4 SV142.6 SV142.8 SV142.10
N$683: SV143.1 SV143.3 SV143.5 SV143.7 SV143.9
N$684: SV143.2 SV143.4 SV143.6 SV143.8 SV143.10
N$685: SV144.1 SV144.3 SV144.5 SV144.7 SV144.9
N$686: SV144.2 SV144.4 SV144.6 SV144.8 SV144.10
N$687: SV145.1 SV145.3 SV145.5 SV145.7 SV145.9
N$688: SV145.2 SV145.4 SV145.6 SV145.8 SV145.10
N$689: SV146.1 SV146.3 SV146.5 SV146.7 SV146.9
N$690: SV146.2 SV146.4 SV146.6 SV146.8 SV146.10
N$691: SV147.1 SV147.3 SV147.5 SV147.7 SV147.9
N$692: SV147.2 SV147.4 SV147.6 SV147.8 SV147.10
N$693: SV148.1 SV148.3 SV148.5 SV148.7 SV148.9
N$694: SV148.2 SV148.4 SV148.6 SV148.8 SV148.10
VCC [supply]: SV3.1 SV3.2 SV3.3 SV3.4 SV3.5 SV3.6 SV3.7 SV3.8 SV3.9 SV3.10 SV3.11 SV3.12 SV5.1 SV5.2 SV5.3 SV5.4 SV5.5 SV5.6 SV5.7 SV5.8 SV5.9 SV5.10 SV6.1 SV6.2 SV6.3 SV6.4 SV6.5 SV6.6 SV6.7 SV6.8 SV6.9 SV6.10 SV6.11 SV6.12 SV10.1 SV10.2 SV10.3 SV10.4 SV10.5 SV10.6 SV10.7 SV10.8 SV10.9 SV10.10 SV10.11 SV10.12 SV11.1 SV11.2 SV11.3 SV11.4 SV11.5 SV11.6 SV11.7 SV11.8 SV11.9 SV11.10 SV125.1 SV125.2 SV125.3 SV125.4 SV125.5 SV125.6 SV125.7 SV125.8 SV125.9 SV125.10 SV129.1 SV129.2 SV129.3 SV129.4 SV129.5 SV129.6 SV129.7 SV129.8 SV129.9 SV129.10 SV129.11 SV129.12 SV175.1 SV175.2 SV175.3 SV175.4 SV175.5 SV175.6 SV175.7 SV175.8 SV175.9 SV175.10 SV175.11 SV175.12 SV178.1 SV178.2 SV178.3 SV178.4 SV178.5 SV178.6 SV178.7 SV178.8 SV178.9 SV178.10 SV179.1 SV179.2 SV179.3 SV179.4 SV179.5 SV179.6 SV179.7 SV179.8 SV179.9 SV179.10 SV179.11 SV179.12 SV180.1 SV180.2 SV180.3 SV180.4 SV180.5 SV180.6 SV180.7 SV180.8 SV180.9 SV180.10 SV180.11 SV180.12 SV181.1 SV181.2 SV181.3 SV181.4 SV181.5 SV181.6 SV181.7 SV181.8 SV181.9 SV181.10 SV181.11 SV181.12 ; also sheet 1,2,4

### Notes on the sheet
- PDP-8/E Compatible I/O Breadboard
- Douglas Electronics

## Sheet 4 of 4
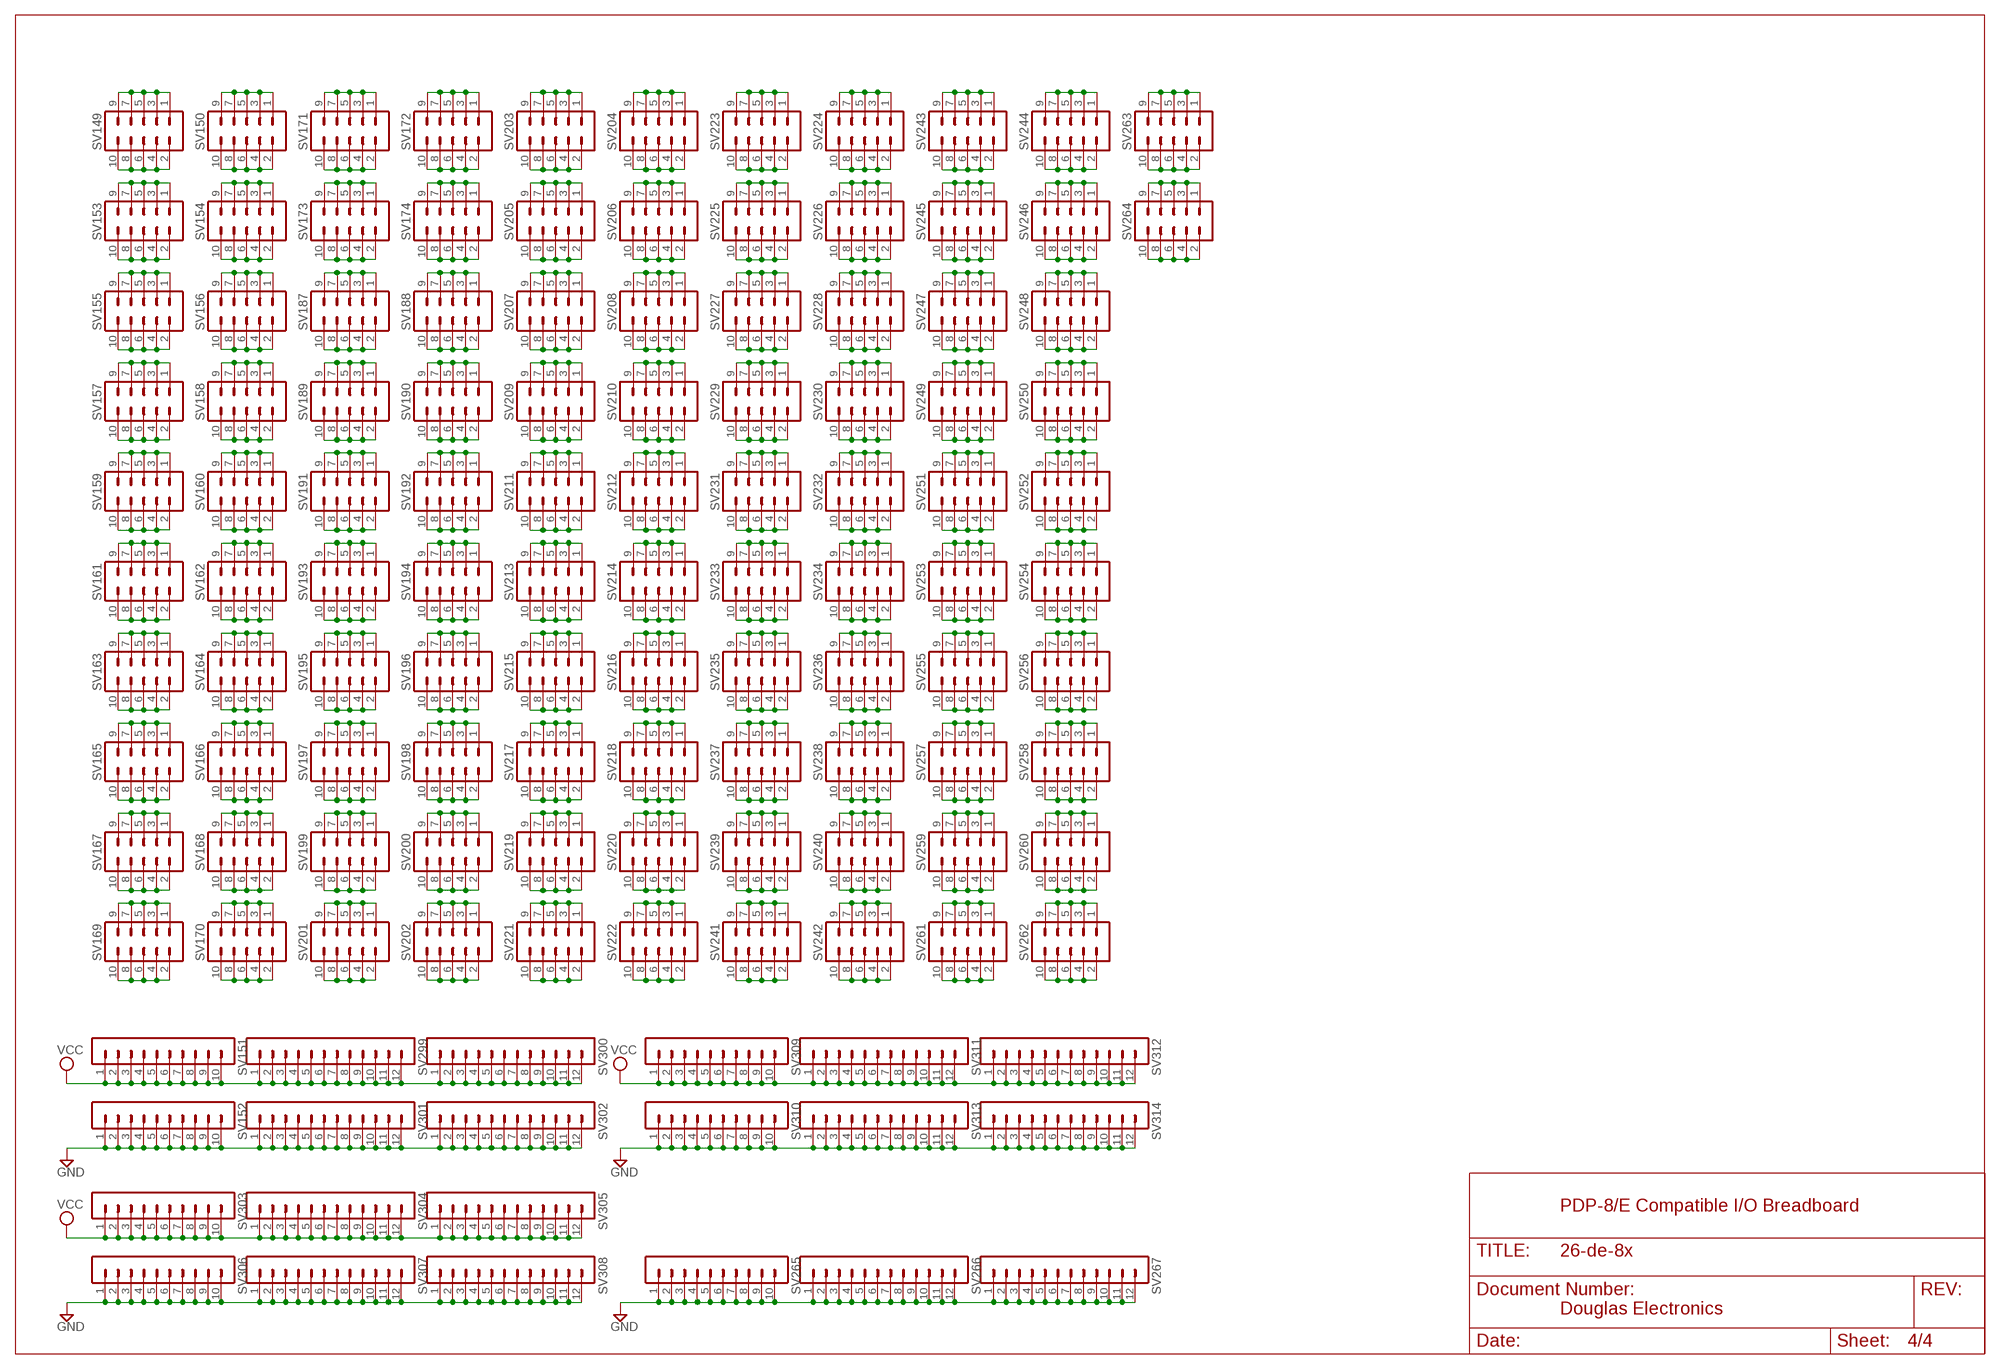
[diagram p3: schematic, sheet 4]

### Parts
SV149  MA05-2  [MA05-2]
SV150  MA05-2  [MA05-2]
SV151  MA10-1  [MA10-1]
SV152  MA10-1  [MA10-1]
SV153  MA05-2  [MA05-2]
SV154  MA05-2  [MA05-2]
SV155  MA05-2  [MA05-2]
SV156  MA05-2  [MA05-2]
SV157  MA05-2  [MA05-2]
SV158  MA05-2  [MA05-2]
SV159  MA05-2  [MA05-2]
SV160  MA05-2  [MA05-2]
SV161  MA05-2  [MA05-2]
SV162  MA05-2  [MA05-2]
SV163  MA05-2  [MA05-2]
SV164  MA05-2  [MA05-2]
SV165  MA05-2  [MA05-2]
SV166  MA05-2  [MA05-2]
SV167  MA05-2  [MA05-2]
SV168  MA05-2  [MA05-2]
SV169  MA05-2  [MA05-2]
SV170  MA05-2  [MA05-2]
SV171  MA05-2  [MA05-2]
SV172  MA05-2  [MA05-2]
SV173  MA05-2  [MA05-2]
SV174  MA05-2  [MA05-2]
SV187  MA05-2  [MA05-2]
SV188  MA05-2  [MA05-2]
SV189  MA05-2  [MA05-2]
SV190  MA05-2  [MA05-2]
SV191  MA05-2  [MA05-2]
SV192  MA05-2  [MA05-2]
SV193  MA05-2  [MA05-2]
SV194  MA05-2  [MA05-2]
SV195  MA05-2  [MA05-2]
SV196  MA05-2  [MA05-2]
SV197  MA05-2  [MA05-2]
SV198  MA05-2  [MA05-2]
SV199  MA05-2  [MA05-2]
SV200  MA05-2  [MA05-2]
SV201  MA05-2  [MA05-2]
SV202  MA05-2  [MA05-2]
SV203  MA05-2  [MA05-2]
SV204  MA05-2  [MA05-2]
SV205  MA05-2  [MA05-2]
SV206  MA05-2  [MA05-2]
SV207  MA05-2  [MA05-2]
SV208  MA05-2  [MA05-2]
SV209  MA05-2  [MA05-2]
SV210  MA05-2  [MA05-2]
SV211  MA05-2  [MA05-2]
SV212  MA05-2  [MA05-2]
SV213  MA05-2  [MA05-2]
SV214  MA05-2  [MA05-2]
SV215  MA05-2  [MA05-2]
SV216  MA05-2  [MA05-2]
SV217  MA05-2  [MA05-2]
SV218  MA05-2  [MA05-2]
SV219  MA05-2  [MA05-2]
SV220  MA05-2  [MA05-2]
SV221  MA05-2  [MA05-2]
SV222  MA05-2  [MA05-2]
SV223  MA05-2  [MA05-2]
SV224  MA05-2  [MA05-2]
SV225  MA05-2  [MA05-2]
SV226  MA05-2  [MA05-2]
SV227  MA05-2  [MA05-2]
SV228  MA05-2  [MA05-2]
SV229  MA05-2  [MA05-2]
SV230  MA05-2  [MA05-2]
SV231  MA05-2  [MA05-2]
SV232  MA05-2  [MA05-2]
SV233  MA05-2  [MA05-2]
SV234  MA05-2  [MA05-2]
SV235  MA05-2  [MA05-2]
SV236  MA05-2  [MA05-2]
SV237  MA05-2  [MA05-2]
SV238  MA05-2  [MA05-2]
SV239  MA05-2  [MA05-2]
SV240  MA05-2  [MA05-2]
SV241  MA05-2  [MA05-2]
SV242  MA05-2  [MA05-2]
SV243  MA05-2  [MA05-2]
SV244  MA05-2  [MA05-2]
SV245  MA05-2  [MA05-2]
SV246  MA05-2  [MA05-2]
SV247  MA05-2  [MA05-2]
SV248  MA05-2  [MA05-2]
SV249  MA05-2  [MA05-2]
SV250  MA05-2  [MA05-2]
SV251  MA05-2  [MA05-2]
SV252  MA05-2  [MA05-2]
SV253  MA05-2  [MA05-2]
SV254  MA05-2  [MA05-2]
SV255  MA05-2  [MA05-2]
SV256  MA05-2  [MA05-2]
SV257  MA05-2  [MA05-2]
SV258  MA05-2  [MA05-2]
SV259  MA05-2  [MA05-2]
SV260  MA05-2  [MA05-2]
SV261  MA05-2  [MA05-2]
SV262  MA05-2  [MA05-2]
SV263  MA05-2  [MA05-2]
SV264  MA05-2  [MA05-2]
SV265  MA10-1  [MA10-1]
SV266  MA12-1  [MA12-1]
SV267  MA12-1  [MA12-1]
SV299  MA12-1  [MA12-1]
SV300  MA12-1  [MA12-1]
SV301  MA12-1  [MA12-1]
SV302  MA12-1  [MA12-1]
SV303  MA10-1  [MA10-1]
SV304  MA12-1  [MA12-1]
SV305  MA12-1  [MA12-1]
SV306  MA10-1  [MA10-1]
SV307  MA12-1  [MA12-1]
SV308  MA12-1  [MA12-1]
SV309  MA10-1  [MA10-1]
SV310  MA10-1  [MA10-1]
SV311  MA12-1  [MA12-1]
SV312  MA12-1  [MA12-1]
SV313  MA12-1  [MA12-1]
SV314  MA12-1  [MA12-1]

### Nets
GND [supply]: SV152.1 SV152.2 SV152.3 SV152.4 SV152.5 SV152.6 SV152.7 SV152.8 SV152.9 SV152.10 SV265.1 SV265.2 SV265.3 SV265.4 SV265.5 SV265.6 SV265.7 SV265.8 SV265.9 SV265.10 SV266.1 SV266.2 SV266.3 SV266.4 SV266.5 SV266.6 SV266.7 SV266.8 SV266.9 SV266.10 SV266.11 SV266.12 SV267.1 SV267.2 SV267.3 SV267.4 SV267.5 SV267.6 SV267.7 SV267.8 SV267.9 SV267.10 SV267.11 SV267.12 SV301.1 SV301.2 SV301.3 SV301.4 SV301.5 SV301.6 SV301.7 SV301.8 SV301.9 SV301.10 SV301.11 SV301.12 SV302.1 SV302.2 SV302.3 SV302.4 SV302.5 SV302.6 SV302.7 SV302.8 SV302.9 SV302.10 SV302.11 SV302.12 SV306.1 SV306.2 SV306.3 SV306.4 SV306.5 SV306.6 SV306.7 SV306.8 SV306.9 SV306.10 SV307.1 SV307.2 SV307.3 SV307.4 SV307.5 SV307.6 SV307.7 SV307.8 SV307.9 SV307.10 SV307.11 SV307.12 SV308.1 SV308.2 SV308.3 SV308.4 SV308.5 SV308.6 SV308.7 SV308.8 SV308.9 SV308.10 SV308.11 SV308.12 SV310.1 SV310.2 SV310.3 SV310.4 SV310.5 SV310.6 SV310.7 SV310.8 SV310.9 SV310.10 SV313.1 SV313.2 SV313.3 SV313.4 SV313.5 SV313.6 SV313.7 SV313.8 SV313.9 SV313.10 SV313.11 SV313.12 SV314.1 SV314.2 SV314.3 SV314.4 SV314.5 SV314.6 SV314.7 SV314.8 SV314.9 SV314.10 SV314.11 SV314.12 ; also sheet 1,2,3
N$26: SV149.1 SV149.3 SV149.5 SV149.7 SV149.9
N$27: SV149.2 SV149.4 SV149.6 SV149.8 SV149.10
N$28: SV150.1 SV150.3 SV150.5 SV150.7 SV150.9
N$29: SV150.2 SV150.4 SV150.6 SV150.8 SV150.10
N$30: SV153.1 SV153.3 SV153.5 SV153.7 SV153.9
N$31: SV153.2 SV153.4 SV153.6 SV153.8 SV153.10
N$32: SV154.1 SV154.3 SV154.5 SV154.7 SV154.9
N$33: SV154.2 SV154.4 SV154.6 SV154.8 SV154.10
N$34: SV155.1 SV155.3 SV155.5 SV155.7 SV155.9
N$35: SV155.2 SV155.4 SV155.6 SV155.8 SV155.10
N$36: SV156.1 SV156.3 SV156.5 SV156.7 SV156.9
N$37: SV156.2 SV156.4 SV156.6 SV156.8 SV156.10
N$38: SV157.1 SV157.3 SV157.5 SV157.7 SV157.9
N$39: SV157.2 SV157.4 SV157.6 SV157.8 SV157.10
N$40: SV158.1 SV158.3 SV158.5 SV158.7 SV158.9
N$41: SV158.2 SV158.4 SV158.6 SV158.8 SV158.10
N$55: SV159.1 SV159.3 SV159.5 SV159.7 SV159.9
N$56: SV159.2 SV159.4 SV159.6 SV159.8 SV159.10
N$57: SV160.1 SV160.3 SV160.5 SV160.7 SV160.9
N$58: SV160.2 SV160.4 SV160.6 SV160.8 SV160.10
N$59: SV161.1 SV161.3 SV161.5 SV161.7 SV161.9
N$60: SV161.2 SV161.4 SV161.6 SV161.8 SV161.10
N$61: SV162.1 SV162.3 SV162.5 SV162.7 SV162.9
N$62: SV162.2 SV162.4 SV162.6 SV162.8 SV162.10
N$63: SV163.1 SV163.3 SV163.5 SV163.7 SV163.9
N$64: SV163.2 SV163.4 SV163.6 SV163.8 SV163.10
N$65: SV164.1 SV164.3 SV164.5 SV164.7 SV164.9
N$66: SV164.2 SV164.4 SV164.6 SV164.8 SV164.10
N$67: SV165.1 SV165.3 SV165.5 SV165.7 SV165.9
N$68: SV165.2 SV165.4 SV165.6 SV165.8 SV165.10
N$69: SV166.1 SV166.3 SV166.5 SV166.7 SV166.9
N$70: SV166.2 SV166.4 SV166.6 SV166.8 SV166.10
N$71: SV167.1 SV167.3 SV167.5 SV167.7 SV167.9
N$72: SV167.2 SV167.4 SV167.6 SV167.8 SV167.10
N$73: SV168.1 SV168.3 SV168.5 SV168.7 SV168.9
N$74: SV168.2 SV168.4 SV168.6 SV168.8 SV168.10
N$75: SV169.1 SV169.3 SV169.5 SV169.7 SV169.9
N$76: SV169.2 SV169.4 SV169.6 SV169.8 SV169.10
N$77: SV170.1 SV170.3 SV170.5 SV170.7 SV170.9
N$78: SV170.2 SV170.4 SV170.6 SV170.8 SV170.10
N$79: SV171.1 SV171.3 SV171.5 SV171.7 SV171.9
N$80: SV171.2 SV171.4 SV171.6 SV171.8 SV171.10
N$81: SV172.1 SV172.3 SV172.5 SV172.7 SV172.9
N$82: SV172.2 SV172.4 SV172.6 SV172.8 SV172.10
N$83: SV173.1 SV173.3 SV173.5 SV173.7 SV173.9
N$84: SV173.2 SV173.4 SV173.6 SV173.8 SV173.10
N$85: SV174.1 SV174.3 SV174.5 SV174.7 SV174.9
N$86: SV174.2 SV174.4 SV174.6 SV174.8 SV174.10
N$87: SV187.1 SV187.3 SV187.5 SV187.7 SV187.9
N$88: SV187.2 SV187.4 SV187.6 SV187.8 SV187.10
N$89: SV188.1 SV188.3 SV188.5 SV188.7 SV188.9
N$90: SV188.2 SV188.4 SV188.6 SV188.8 SV188.10
N$91: SV189.1 SV189.3 SV189.5 SV189.7 SV189.9
N$92: SV189.2 SV189.4 SV189.6 SV189.8 SV189.10
N$93: SV190.1 SV190.3 SV190.5 SV190.7 SV190.9
N$94: SV190.2 SV190.4 SV190.6 SV190.8 SV190.10
N$95: SV191.1 SV191.3 SV191.5 SV191.7 SV191.9
N$96: SV191.2 SV191.4 SV191.6 SV191.8 SV191.10
N$97: SV192.1 SV192.3 SV192.5 SV192.7 SV192.9
N$98: SV192.2 SV192.4 SV192.6 SV192.8 SV192.10
N$99: SV193.1 SV193.3 SV193.5 SV193.7 SV193.9
N$100: SV193.2 SV193.4 SV193.6 SV193.8 SV193.10
N$101: SV194.1 SV194.3 SV194.5 SV194.7 SV194.9
N$102: SV194.2 SV194.4 SV194.6 SV194.8 SV194.10
N$103: SV195.1 SV195.3 SV195.5 SV195.7 SV195.9
N$104: SV195.2 SV195.4 SV195.6 SV195.8 SV195.10
N$105: SV196.1 SV196.3 SV196.5 SV196.7 SV196.9
N$106: SV196.2 SV196.4 SV196.6 SV196.8 SV196.10
N$107: SV197.1 SV197.3 SV197.5 SV197.7 SV197.9
N$108: SV197.2 SV197.4 SV197.6 SV197.8 SV197.10
N$109: SV198.1 SV198.3 SV198.5 SV198.7 SV198.9
N$110: SV198.2 SV198.4 SV198.6 SV198.8 SV198.10
N$111: SV199.1 SV199.3 SV199.5 SV199.7 SV199.9
N$112: SV199.2 SV199.4 SV199.6 SV199.8 SV199.10
N$113: SV200.1 SV200.3 SV200.5 SV200.7 SV200.9
N$114: SV200.2 SV200.4 SV200.6 SV200.8 SV200.10
N$115: SV201.1 SV201.3 SV201.5 SV201.7 SV201.9
N$116: SV201.2 SV201.4 SV201.6 SV201.8 SV201.10
N$117: SV202.1 SV202.3 SV202.5 SV202.7 SV202.9
N$118: SV202.2 SV202.4 SV202.6 SV202.8 SV202.10
N$119: SV203.1 SV203.3 SV203.5 SV203.7 SV203.9
N$120: SV203.2 SV203.4 SV203.6 SV203.8 SV203.10
N$121: SV204.1 SV204.3 SV204.5 SV204.7 SV204.9
N$122: SV204.2 SV204.4 SV204.6 SV204.8 SV204.10
N$123: SV205.1 SV205.3 SV205.5 SV205.7 SV205.9
N$124: SV205.2 SV205.4 SV205.6 SV205.8 SV205.10
N$125: SV206.1 SV206.3 SV206.5 SV206.7 SV206.9
N$126: SV206.2 SV206.4 SV206.6 SV206.8 SV206.10
N$127: SV207.1 SV207.3 SV207.5 SV207.7 SV207.9
N$128: SV207.2 SV207.4 SV207.6 SV207.8 SV207.10
N$129: SV208.1 SV208.3 SV208.5 SV208.7 SV208.9
N$130: SV208.2 SV208.4 SV208.6 SV208.8 SV208.10
N$131: SV209.1 SV209.3 SV209.5 SV209.7 SV209.9
N$132: SV209.2 SV209.4 SV209.6 SV209.8 SV209.10
N$133: SV210.1 SV210.3 SV210.5 SV210.7 SV210.9
N$134: SV210.2 SV210.4 SV210.6 SV210.8 SV210.10
N$135: SV211.1 SV211.3 SV211.5 SV211.7 SV211.9
N$136: SV211.2 SV211.4 SV211.6 SV211.8 SV211.10
N$137: SV212.1 SV212.3 SV212.5 SV212.7 SV212.9
N$138: SV212.2 SV212.4 SV212.6 SV212.8 SV212.10
N$139: SV213.1 SV213.3 SV213.5 SV213.7 SV213.9
N$140: SV213.2 SV213.4 SV213.6 SV213.8 SV213.10
N$141: SV214.1 SV214.3 SV214.5 SV214.7 SV214.9
N$142: SV214.2 SV214.4 SV214.6 SV214.8 SV214.10
N$143: SV215.1 SV215.3 SV215.5 SV215.7 SV215.9
N$144: SV215.2 SV215.4 SV215.6 SV215.8 SV215.10
N$145: SV216.1 SV216.3 SV216.5 SV216.7 SV216.9
N$146: SV216.2 SV216.4 SV216.6 SV216.8 SV216.10
N$147: SV217.1 SV217.3 SV217.5 SV217.7 SV217.9
N$148: SV217.2 SV217.4 SV217.6 SV217.8 SV217.10
N$149: SV218.1 SV218.3 SV218.5 SV218.7 SV218.9
N$150: SV218.2 SV218.4 SV218.6 SV218.8 SV218.10
N$151: SV219.1 SV219.3 SV219.5 SV219.7 SV219.9
N$152: SV219.2 SV219.4 SV219.6 SV219.8 SV219.10
N$153: SV220.1 SV220.3 SV220.5 SV220.7 SV220.9
N$154: SV220.2 SV220.4 SV220.6 SV220.8 SV220.10
N$155: SV221.1 SV221.3 SV221.5 SV221.7 SV221.9
N$156: SV221.2 SV221.4 SV221.6 SV221.8 SV221.10
N$157: SV222.1 SV222.3 SV222.5 SV222.7 SV222.9
N$158: SV222.2 SV222.4 SV222.6 SV222.8 SV222.10
N$159: SV223.1 SV223.3 SV223.5 SV223.7 SV223.9
N$160: SV223.2 SV223.4 SV223.6 SV223.8 SV223.10
N$161: SV224.1 SV224.3 SV224.5 SV224.7 SV224.9
N$162: SV224.2 SV224.4 SV224.6 SV224.8 SV224.10
N$163: SV225.1 SV225.3 SV225.5 SV225.7 SV225.9
N$164: SV225.2 SV225.4 SV225.6 SV225.8 SV225.10
N$165: SV226.1 SV226.3 SV226.5 SV226.7 SV226.9
N$166: SV226.2 SV226.4 SV226.6 SV226.8 SV226.10
N$167: SV227.1 SV227.3 SV227.5 SV227.7 SV227.9
N$168: SV227.2 SV227.4 SV227.6 SV227.8 SV227.10
N$169: SV228.1 SV228.3 SV228.5 SV228.7 SV228.9
N$170: SV228.2 SV228.4 SV228.6 SV228.8 SV228.10
N$171: SV229.1 SV229.3 SV229.5 SV229.7 SV229.9
N$172: SV229.2 SV229.4 SV229.6 SV229.8 SV229.10
N$173: SV230.1 SV230.3 SV230.5 SV230.7 SV230.9
N$174: SV230.2 SV230.4 SV230.6 SV230.8 SV230.10
N$175: SV231.1 SV231.3 SV231.5 SV231.7 SV231.9
N$176: SV231.2 SV231.4 SV231.6 SV231.8 SV231.10
N$177: SV232.1 SV232.3 SV232.5 SV232.7 SV232.9
N$178: SV232.2 SV232.4 SV232.6 SV232.8 SV232.10
N$179: SV233.1 SV233.3 SV233.5 SV233.7 SV233.9
N$180: SV233.2 SV233.4 SV233.6 SV233.8 SV233.10
N$181: SV234.1 SV234.3 SV234.5 SV234.7 SV234.9
N$182: SV234.2 SV234.4 SV234.6 SV234.8 SV234.10
N$183: SV235.1 SV235.3 SV235.5 SV235.7 SV235.9
N$184: SV235.2 SV235.4 SV235.6 SV235.8 SV235.10
N$185: SV236.1 SV236.3 SV236.5 SV236.7 SV236.9
N$186: SV236.2 SV236.4 SV236.6 SV236.8 SV236.10
N$187: SV237.1 SV237.3 SV237.5 SV237.7 SV237.9
N$188: SV237.2 SV237.4 SV237.6 SV237.8 SV237.10
N$189: SV238.1 SV238.3 SV238.5 SV238.7 SV238.9
N$190: SV238.2 SV238.4 SV238.6 SV238.8 SV238.10
N$191: SV239.1 SV239.3 SV239.5 SV239.7 SV239.9
N$192: SV239.2 SV239.4 SV239.6 SV239.8 SV239.10
N$193: SV240.1 SV240.3 SV240.5 SV240.7 SV240.9
N$194: SV240.2 SV240.4 SV240.6 SV240.8 SV240.10
N$195: SV241.1 SV241.3 SV241.5 SV241.7 SV241.9
N$196: SV241.2 SV241.4 SV241.6 SV241.8 SV241.10
N$197: SV242.1 SV242.3 SV242.5 SV242.7 SV242.9
N$198: SV242.2 SV242.4 SV242.6 SV242.8 SV242.10
N$199: SV243.1 SV243.3 SV243.5 SV243.7 SV243.9
N$200: SV243.2 SV243.4 SV243.6 SV243.8 SV243.10
N$201: SV244.1 SV244.3 SV244.5 SV244.7 SV244.9
N$202: SV244.2 SV244.4 SV244.6 SV244.8 SV244.10
N$203: SV245.1 SV245.3 SV245.5 SV245.7 SV245.9
N$204: SV245.2 SV245.4 SV245.6 SV245.8 SV245.10
N$205: SV246.1 SV246.3 SV246.5 SV246.7 SV246.9
N$206: SV246.2 SV246.4 SV246.6 SV246.8 SV246.10
N$207: SV247.1 SV247.3 SV247.5 SV247.7 SV247.9
N$208: SV247.2 SV247.4 SV247.6 SV247.8 SV247.10
N$209: SV248.1 SV248.3 SV248.5 SV248.7 SV248.9
N$210: SV248.2 SV248.4 SV248.6 SV248.8 SV248.10
N$211: SV249.1 SV249.3 SV249.5 SV249.7 SV249.9
N$212: SV249.2 SV249.4 SV249.6 SV249.8 SV249.10
N$213: SV250.1 SV250.3 SV250.5 SV250.7 SV250.9
N$214: SV250.2 SV250.4 SV250.6 SV250.8 SV250.10
N$215: SV251.1 SV251.3 SV251.5 SV251.7 SV251.9
N$216: SV251.2 SV251.4 SV251.6 SV251.8 SV251.10
N$217: SV252.1 SV252.3 SV252.5 SV252.7 SV252.9
N$218: SV252.2 SV252.4 SV252.6 SV252.8 SV252.10
N$219: SV253.1 SV253.3 SV253.5 SV253.7 SV253.9
N$220: SV253.2 SV253.4 SV253.6 SV253.8 SV253.10
N$221: SV254.1 SV254.3 SV254.5 SV254.7 SV254.9
N$222: SV254.2 SV254.4 SV254.6 SV254.8 SV254.10
N$223: SV255.1 SV255.3 SV255.5 SV255.7 SV255.9
N$224: SV255.2 SV255.4 SV255.6 SV255.8 SV255.10
N$225: SV256.1 SV256.3 SV256.5 SV256.7 SV256.9
N$226: SV256.2 SV256.4 SV256.6 SV256.8 SV256.10
N$227: SV257.1 SV257.3 SV257.5 SV257.7 SV257.9
N$228: SV257.2 SV257.4 SV257.6 SV257.8 SV257.10
N$229: SV258.1 SV258.3 SV258.5 SV258.7 SV258.9
N$230: SV258.2 SV258.4 SV258.6 SV258.8 SV258.10
N$231: SV259.1 SV259.3 SV259.5 SV259.7 SV259.9
N$232: SV259.2 SV259.4 SV259.6 SV259.8 SV259.10
N$233: SV260.1 SV260.3 SV260.5 SV260.7 SV260.9
N$234: SV260.2 SV260.4 SV260.6 SV260.8 SV260.10
N$235: SV261.1 SV261.3 SV261.5 SV261.7 SV261.9
N$236: SV261.2 SV261.4 SV261.6 SV261.8 SV261.10
N$237: SV262.1 SV262.3 SV262.5 SV262.7 SV262.9
N$238: SV262.2 SV262.4 SV262.6 SV262.8 SV262.10
N$239: SV263.1 SV263.3 SV263.5 SV263.7 SV263.9
N$240: SV263.2 SV263.4 SV263.6 SV263.8 SV263.10
N$241: SV264.1 SV264.3 SV264.5 SV264.7 SV264.9
N$242: SV264.2 SV264.4 SV264.6 SV264.8 SV264.10
VCC [supply]: SV151.1 SV151.2 SV151.3 SV151.4 SV151.5 SV151.6 SV151.7 SV151.8 SV151.9 SV151.10 SV299.1 SV299.2 SV299.3 SV299.4 SV299.5 SV299.6 SV299.7 SV299.8 SV299.9 SV299.10 SV299.11 SV299.12 SV300.1 SV300.2 SV300.3 SV300.4 SV300.5 SV300.6 SV300.7 SV300.8 SV300.9 SV300.10 SV300.11 SV300.12 SV303.1 SV303.2 SV303.3 SV303.4 SV303.5 SV303.6 SV303.7 SV303.8 SV303.9 SV303.10 SV304.1 SV304.2 SV304.3 SV304.4 SV304.5 SV304.6 SV304.7 SV304.8 SV304.9 SV304.10 SV304.11 SV304.12 SV305.1 SV305.2 SV305.3 SV305.4 SV305.5 SV305.6 SV305.7 SV305.8 SV305.9 SV305.10 SV305.11 SV305.12 SV309.1 SV309.2 SV309.3 SV309.4 SV309.5 SV309.6 SV309.7 SV309.8 SV309.9 SV309.10 SV311.1 SV311.2 SV311.3 SV311.4 SV311.5 SV311.6 SV311.7 SV311.8 SV311.9 SV311.10 SV311.11 SV311.12 SV312.1 SV312.2 SV312.3 SV312.4 SV312.5 SV312.6 SV312.7 SV312.8 SV312.9 SV312.10 SV312.11 SV312.12 ; also sheet 1,2,3

### Notes on the sheet
- PDP-8/E Compatible I/O Breadboard
- Douglas Electronics

## Power pins joined to a net without a drawn wire
GND: E1.1(GND:GND) E1.8(PWR:GND) E2.8(GND) E3.1(GND:GND) E3.8(PWR:GND) E4.8(GND) E5.1(GND:GND) E5.8(PWR:GND) E6.7(P:GND) E7.7(P:GND) E8.1(GND:GND) E8.8(PWR:GND) E9.1(GND:GND) E9.8(PWR:GND) E11.1(GND:GND) E11.8(PWR:GND) E12.7(P:GND) E13.7(GND) E14.1(GND:GND) E14.8(PWR:GND) E15.8(GND)
VCC: E1.16(PWR:VCC) E2.16(VCC) E3.16(PWR:VCC) E4.16(VCC) E5.16(PWR:VCC) E6.14(P:VCC) E7.14(P:VCC) E8.16(PWR:VCC) E9.16(PWR:VCC) E11.16(PWR:VCC) E12.14(P:VCC) E13.14(VCC) E14.16(PWR:VCC) E15.16(VCC)

## Library data of the parts
3 3. 4. 5. 6. 7. 8. !A3-!A8 A3-A8 C0 C0. C1 C1. D D0 D1-D11 D. E F0 F1-F7 G I I0 I1-I11 I. R S S. U1A1-U1A22 U1B1-U1B22 U2A1-U2A22 U2B1-U2B22 = wirepad:1,6/0,8: THROUGH-HOLE PAD
BYP1-BYP12 = rcl:C-US: CAPACITOR, American symbol
E1 E3 E5 E8 E9 E11 E14 = dec-con:AM26S10: Bus Transceiver
E2 E15 = 74xx-us:74*174: Hex D type FLIP FLOP, clear
E4 = 74xx-us:74*138: 3-line to 8-line DECODER/DEMULTIPLEXER
E6 = 74xx-us:74*00: Quad 2-input NAND gate
E7 = 74xx-us:74*08: Quad 2-input AND gate
E12 = 74xx-us:74*04: Hex INVERTER
E13 = 74xx-us:74*30: 8-input NAND gate
JA1 JA2 JB1 JB2 JC1 JC2 JD1 JD2 = dec-con:MA18-1
R3 R4 = rcl:R-US_: RESISTOR, American symbol
SV1 SV2 SV7 SV8 SV13-SV124 SV126 SV128 SV130 SV132-SV150 SV153-SV174 SV187-SV264 = con-lstb:MA05-2: PIN HEADER; OC_FARNELL: unknown; OC_NEWARK: unknown
SV3 SV4 SV6 SV9 SV10 SV129 SV175-SV177 SV179-SV183 SV185 SV186 SV266 SV267 SV299-SV302 SV304 SV305 SV307 SV308 SV311-SV314 = con-lstb:MA12-1: PIN HEADER; OC_FARNELL: unknown; OC_NEWARK: unknown
SV5 SV11 SV12 SV125 SV127 SV131 SV151 SV152 SV178 SV184 SV265 SV303 SV306 SV309 SV310 = con-lstb:MA10-1: PIN HEADER; OC_FARNELL: unknown; OC_NEWARK: unknown
U1 U2 = dec-con:133-022-03: Pseudo-edge connector, 22 pins .156" spacing.
U$1 = dec-con:OUTLINE-*: Board outlines for DEC boards.
U$2 = dec-con:QUAD: Quad-Height DEC board

## Net classes
0 default: width 0.813 mm
1 supply: width 0.813 mm